# EAGLE design Projects (EAGLE 9.5.1)
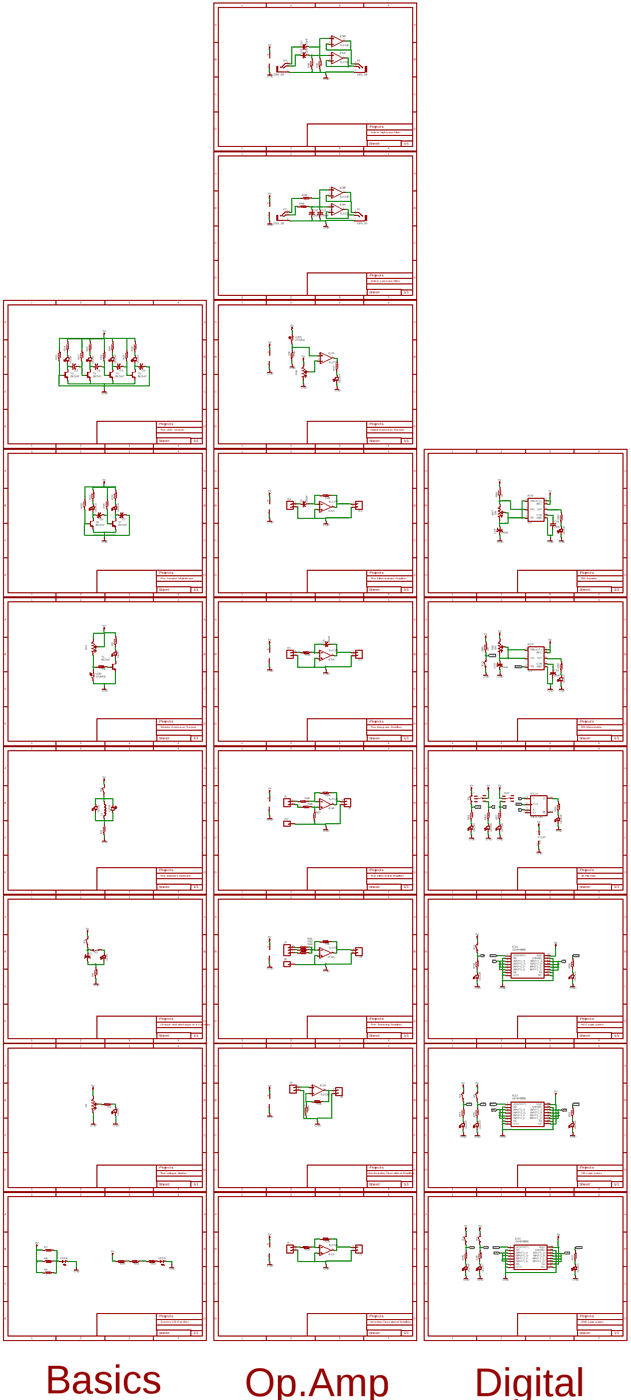
[diagram p0: schematic, sheet 1, overview]
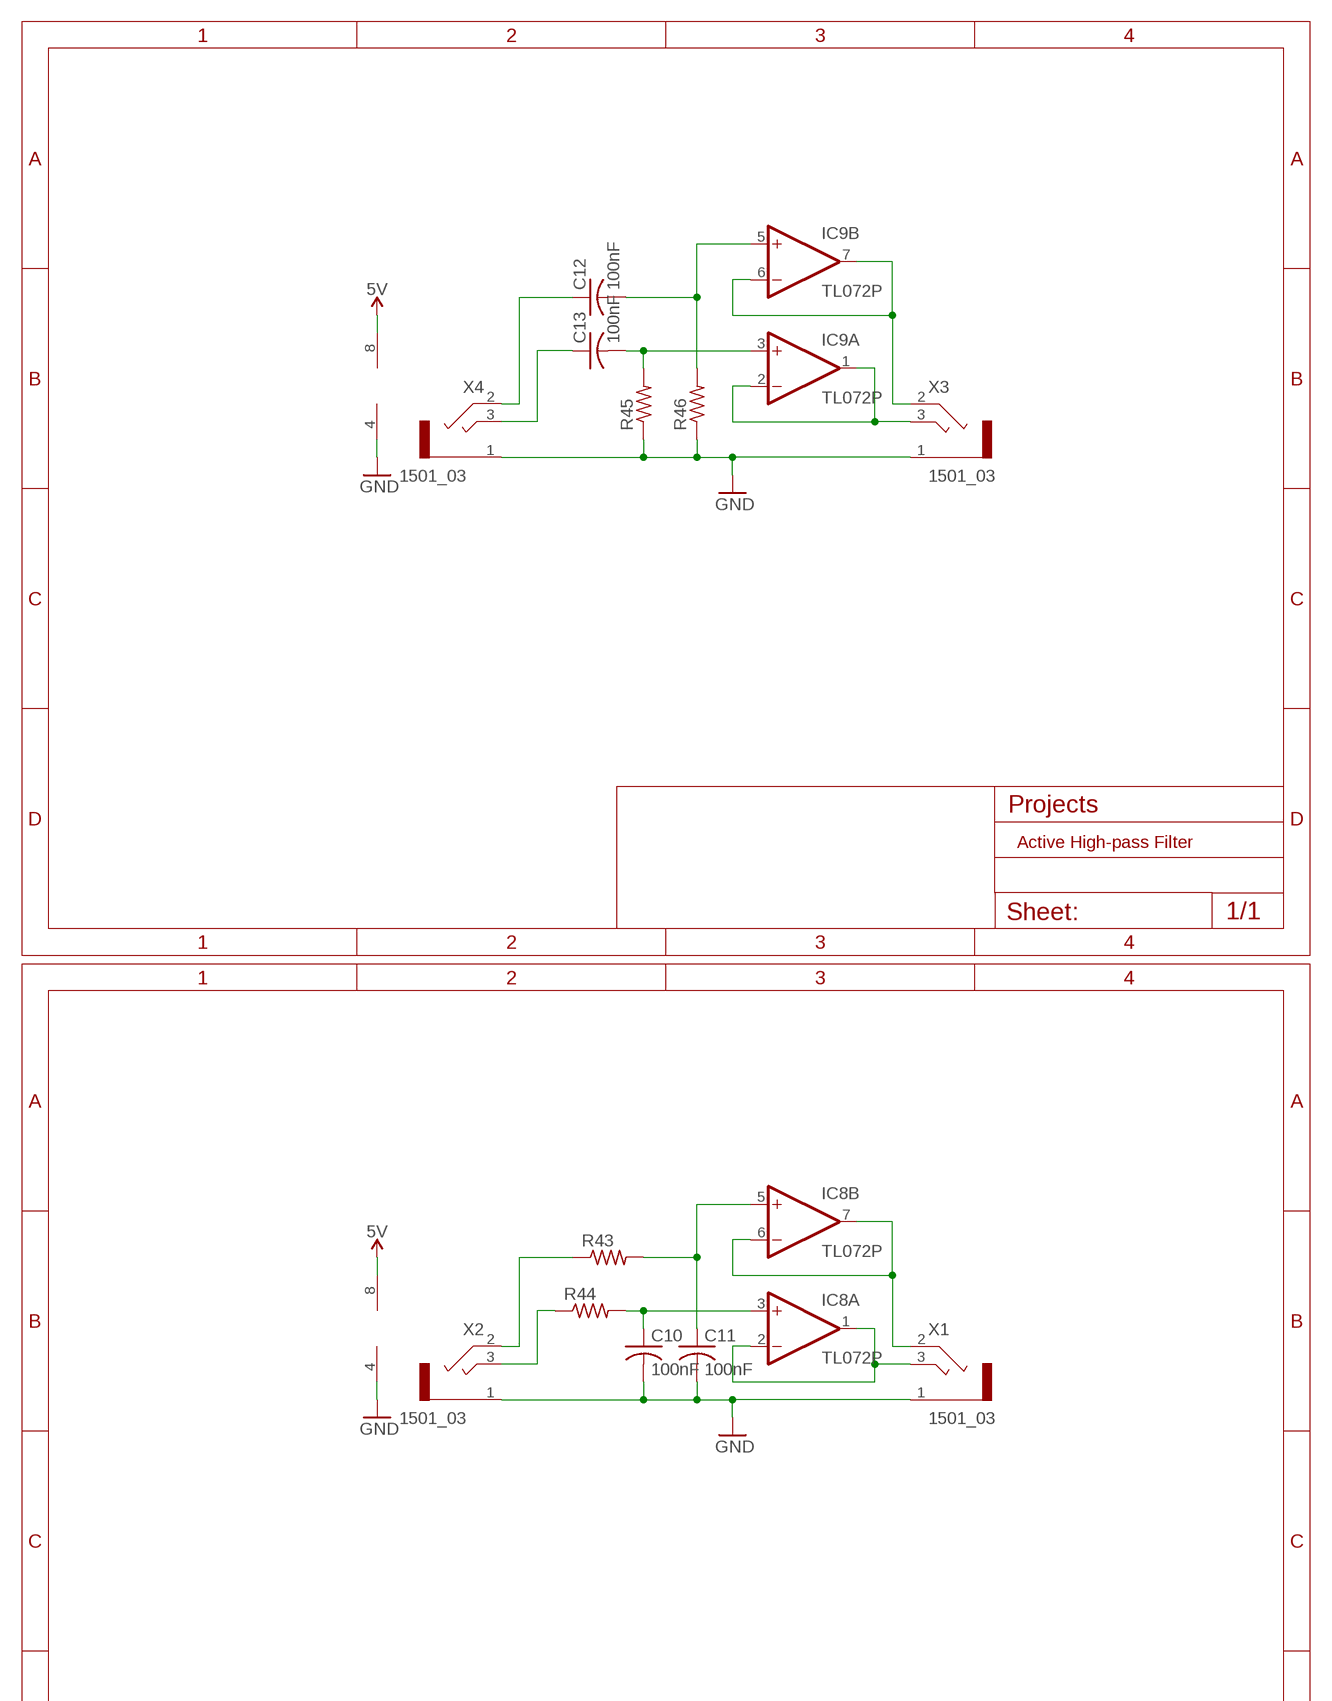
[diagram p1: schematic, sheet 1, part 1 of 7]
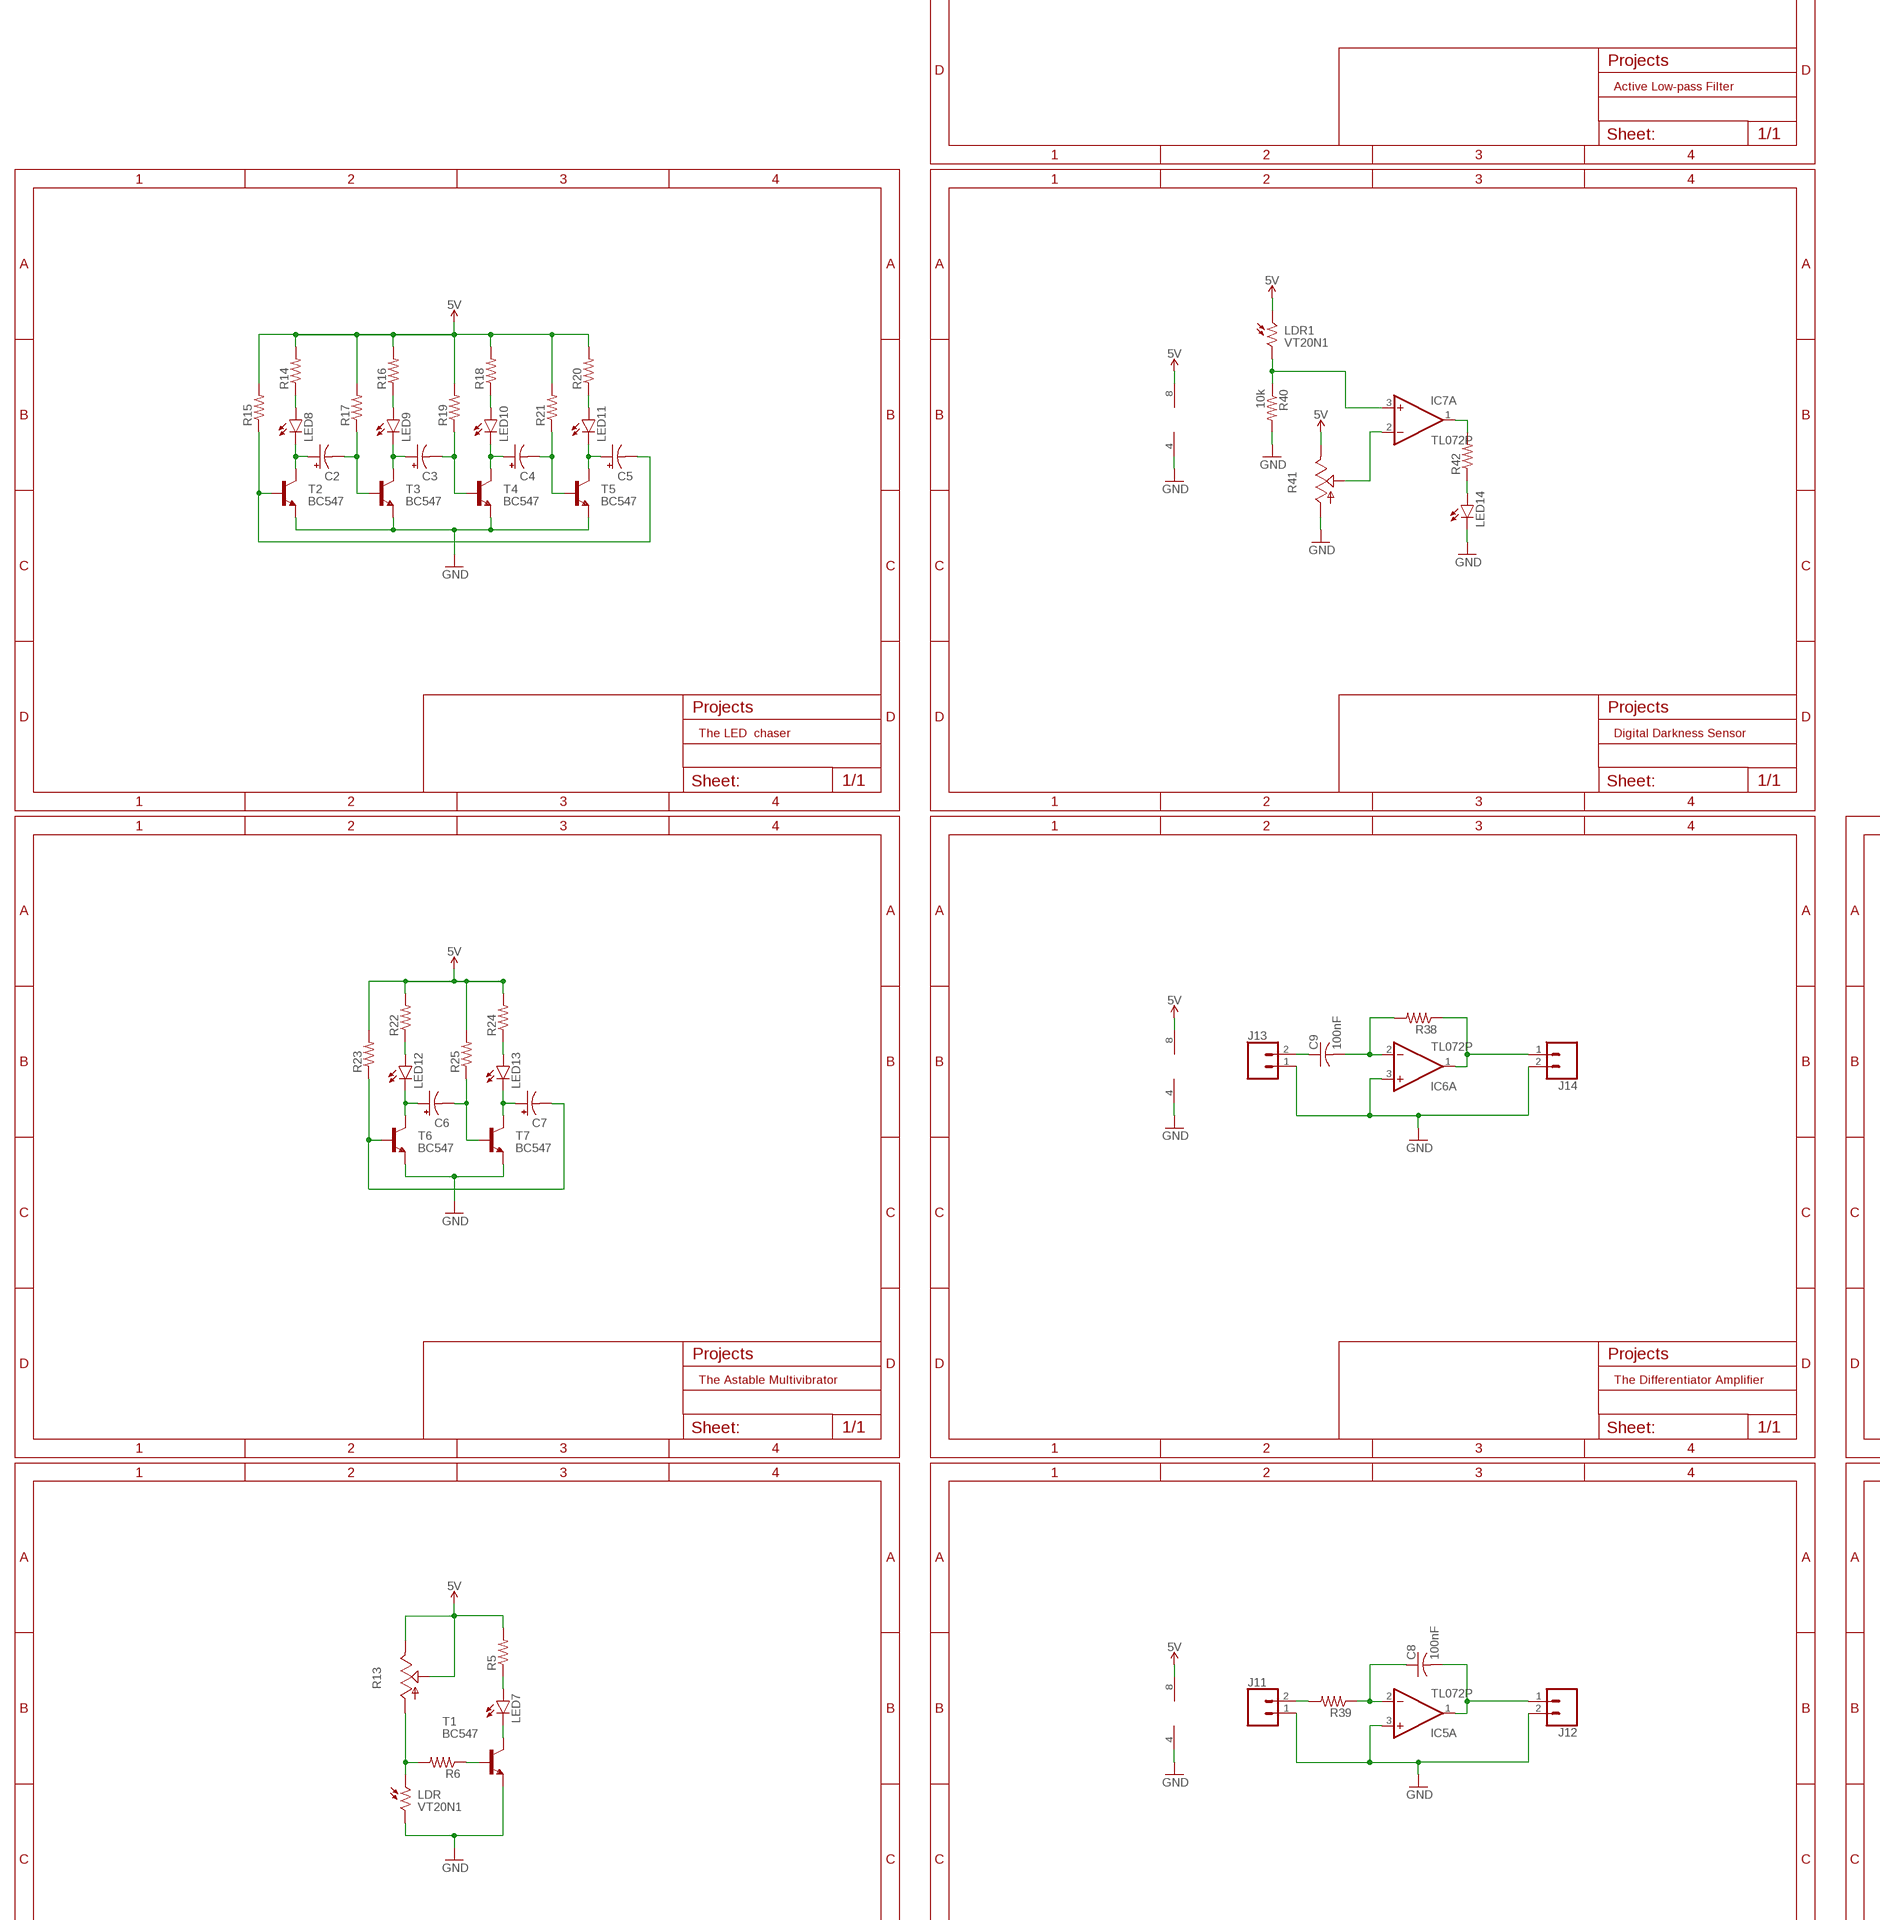
[diagram p2: schematic, sheet 1, part 2 of 7]
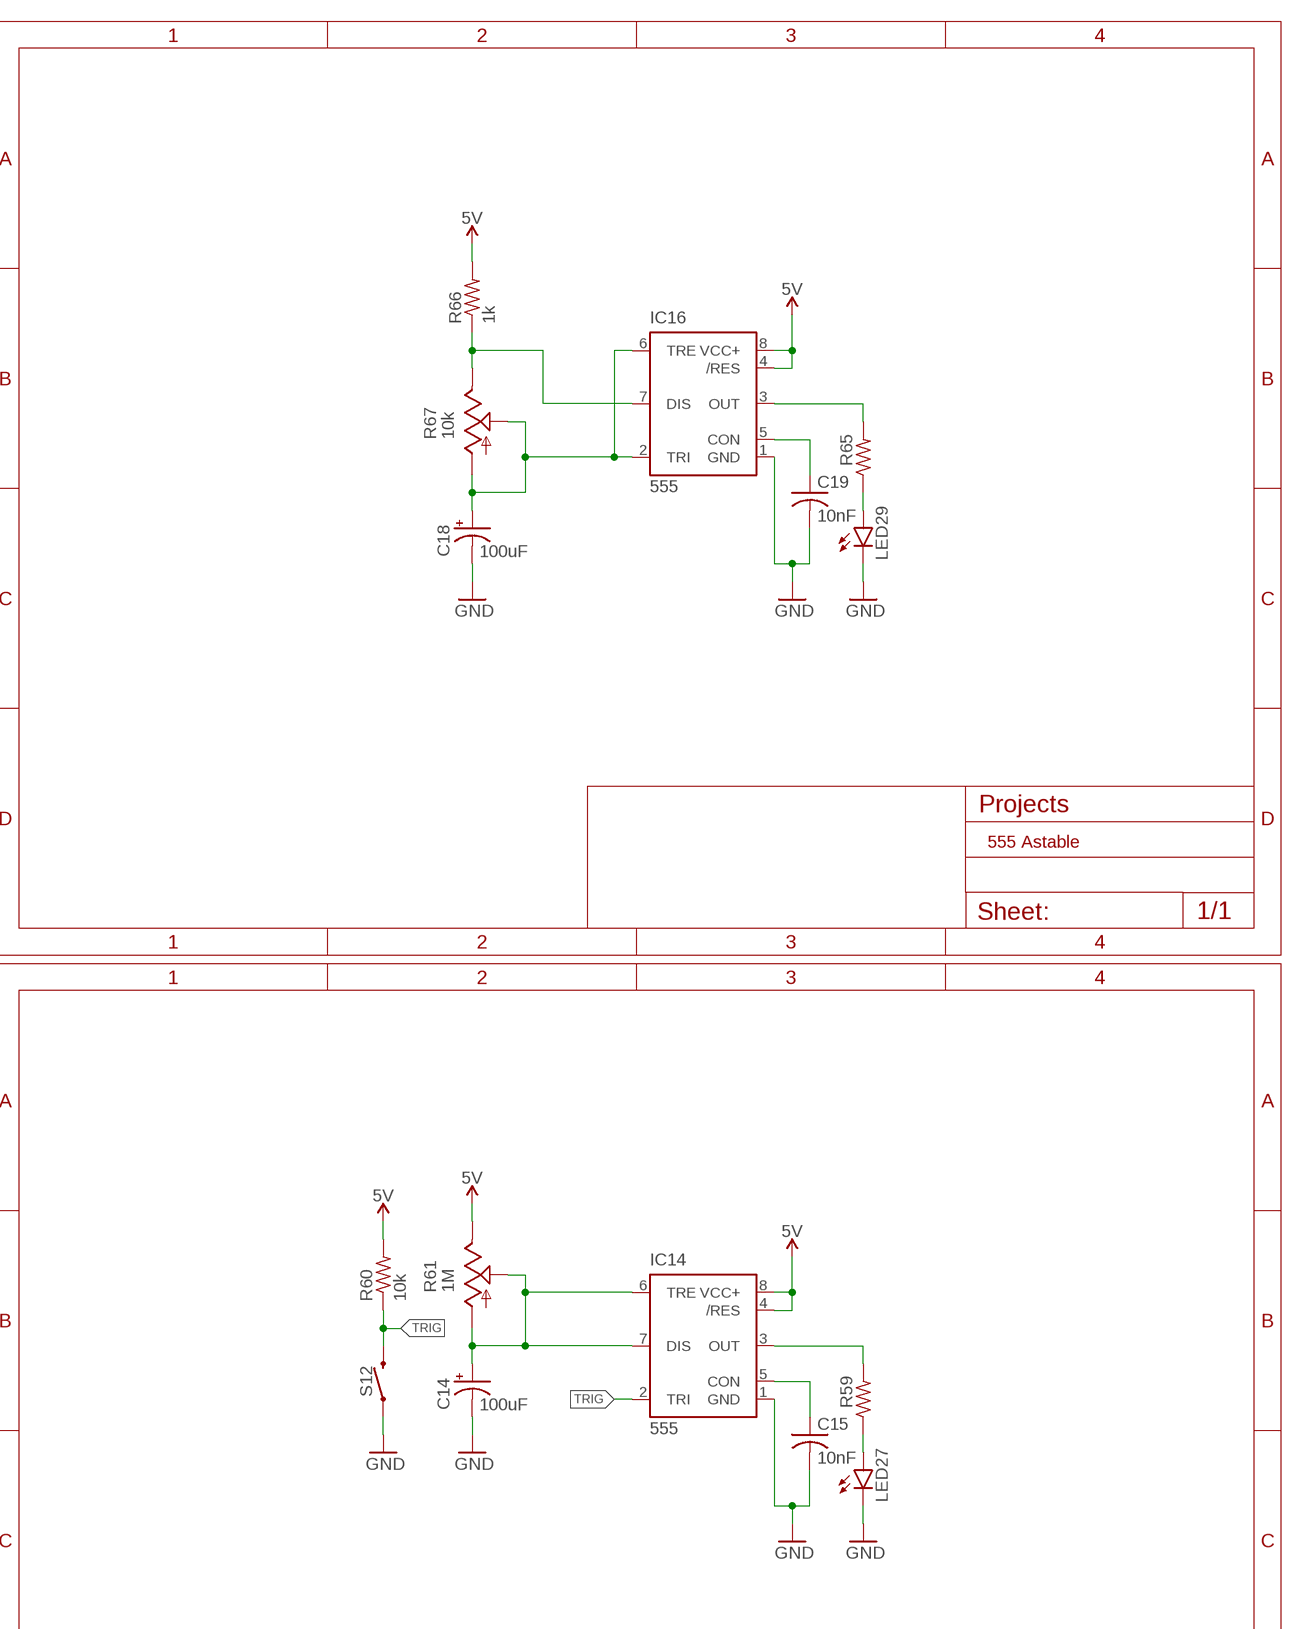
[diagram p3: schematic, sheet 1, part 3 of 7]
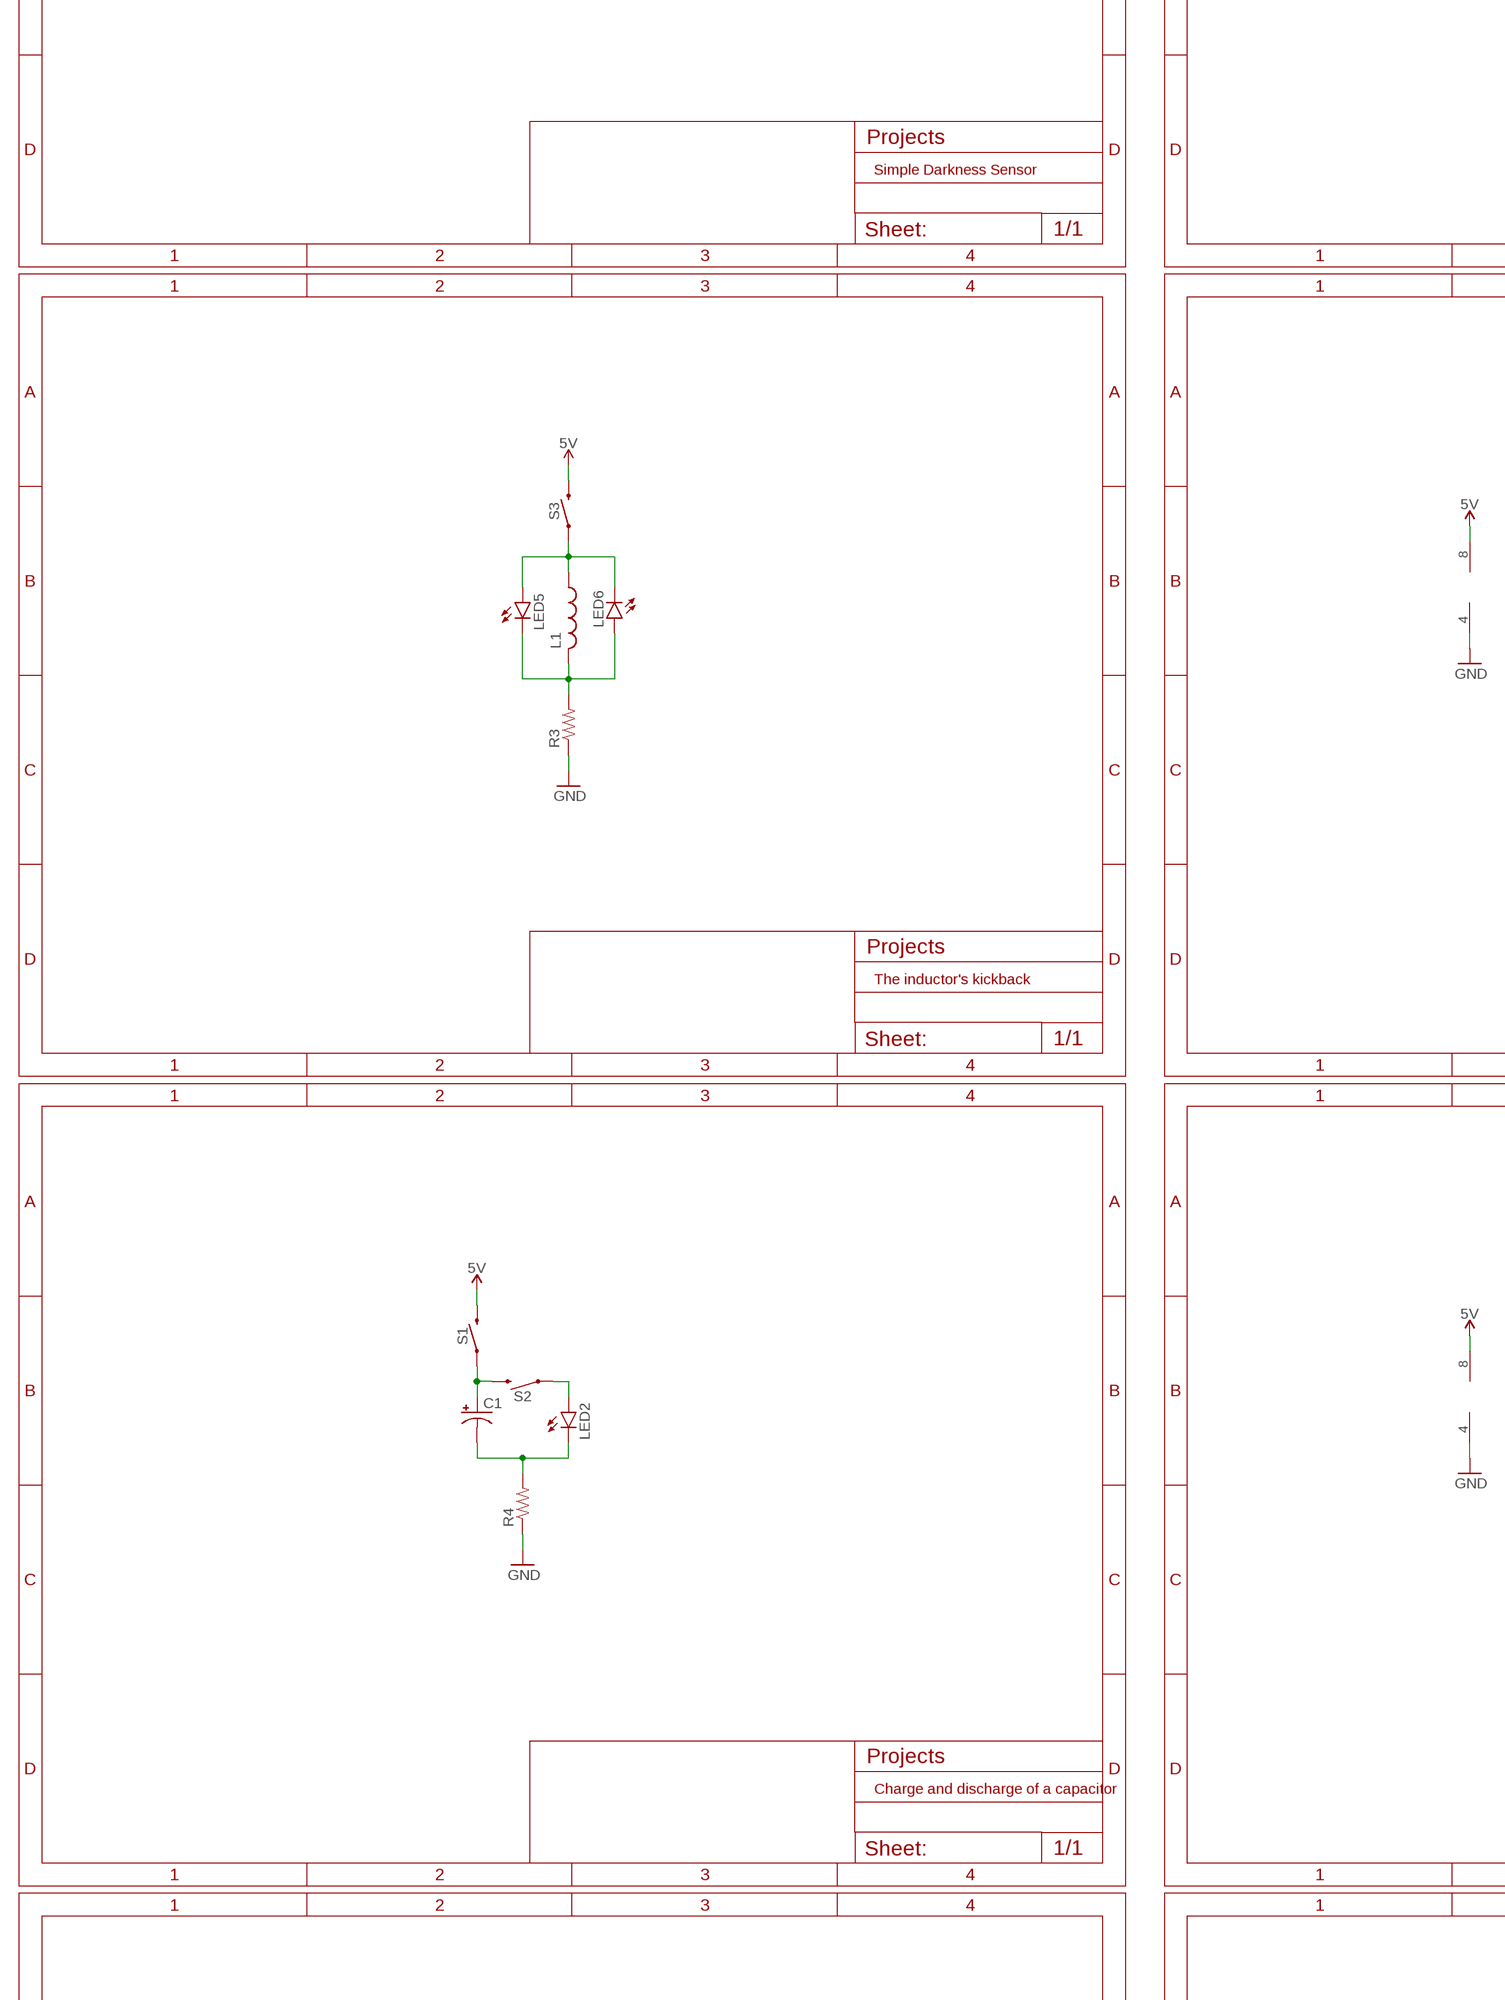
[diagram p4: schematic, sheet 1, part 4 of 7]
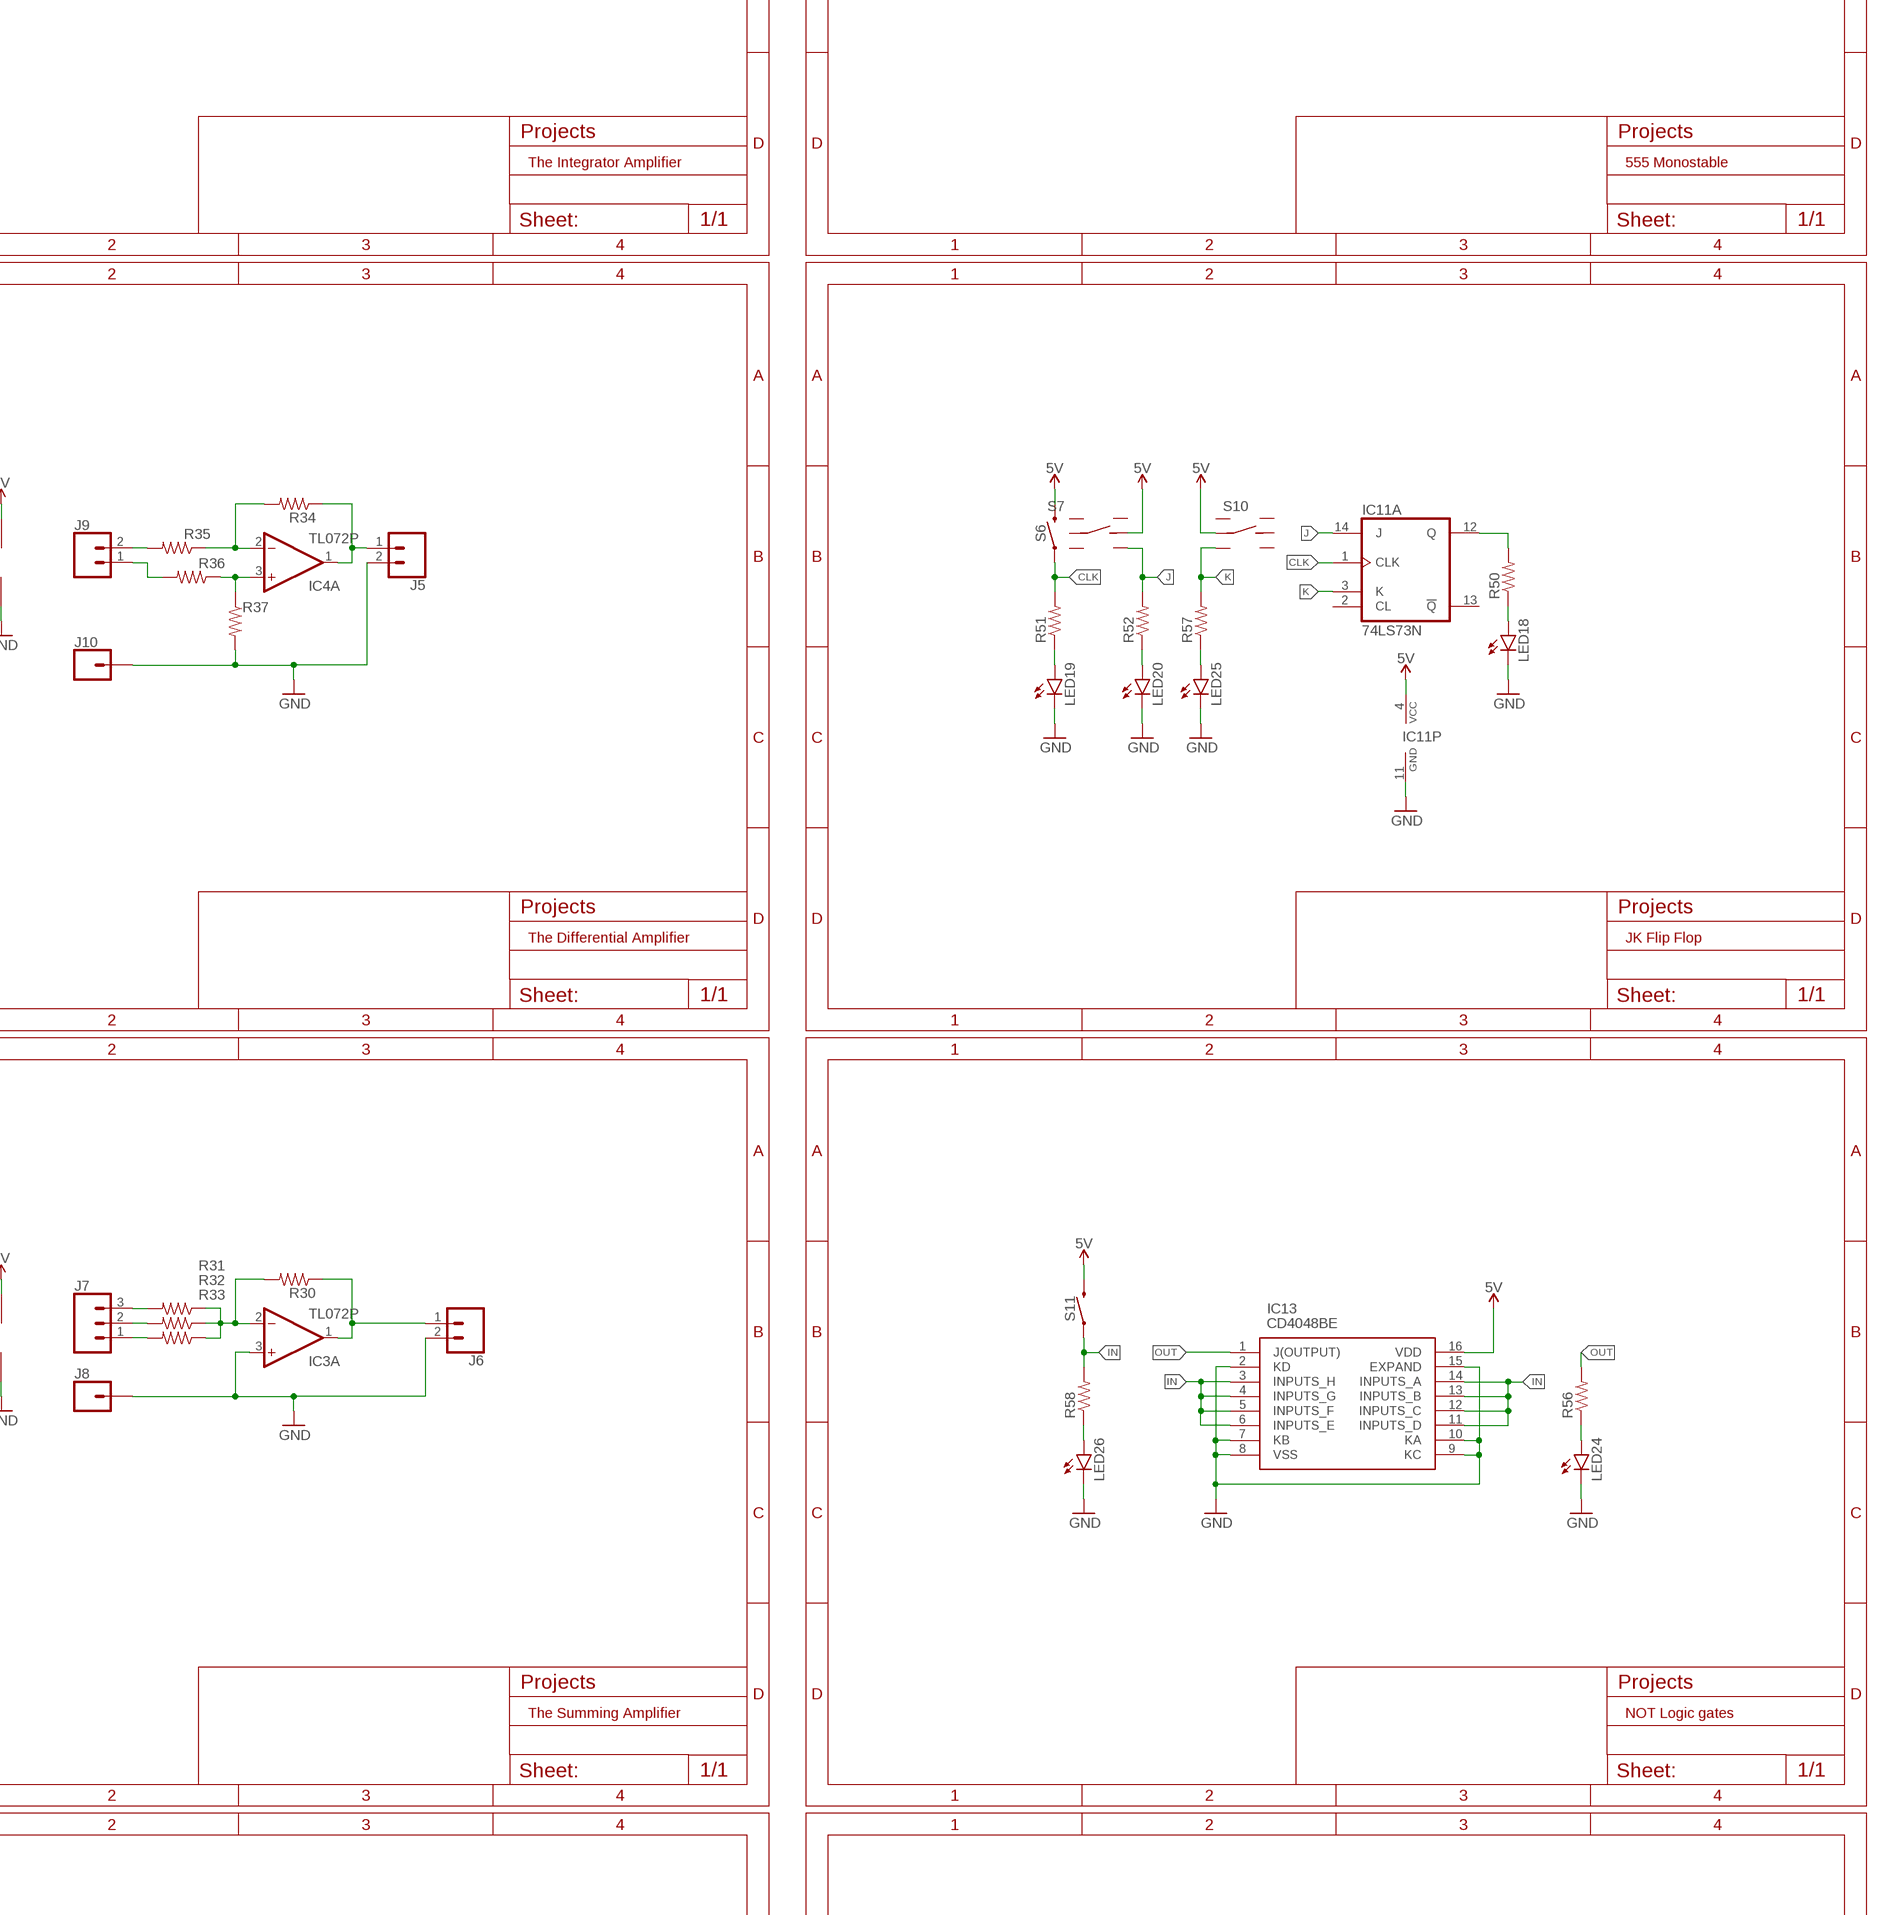
[diagram p5: schematic, sheet 1, part 5 of 7]
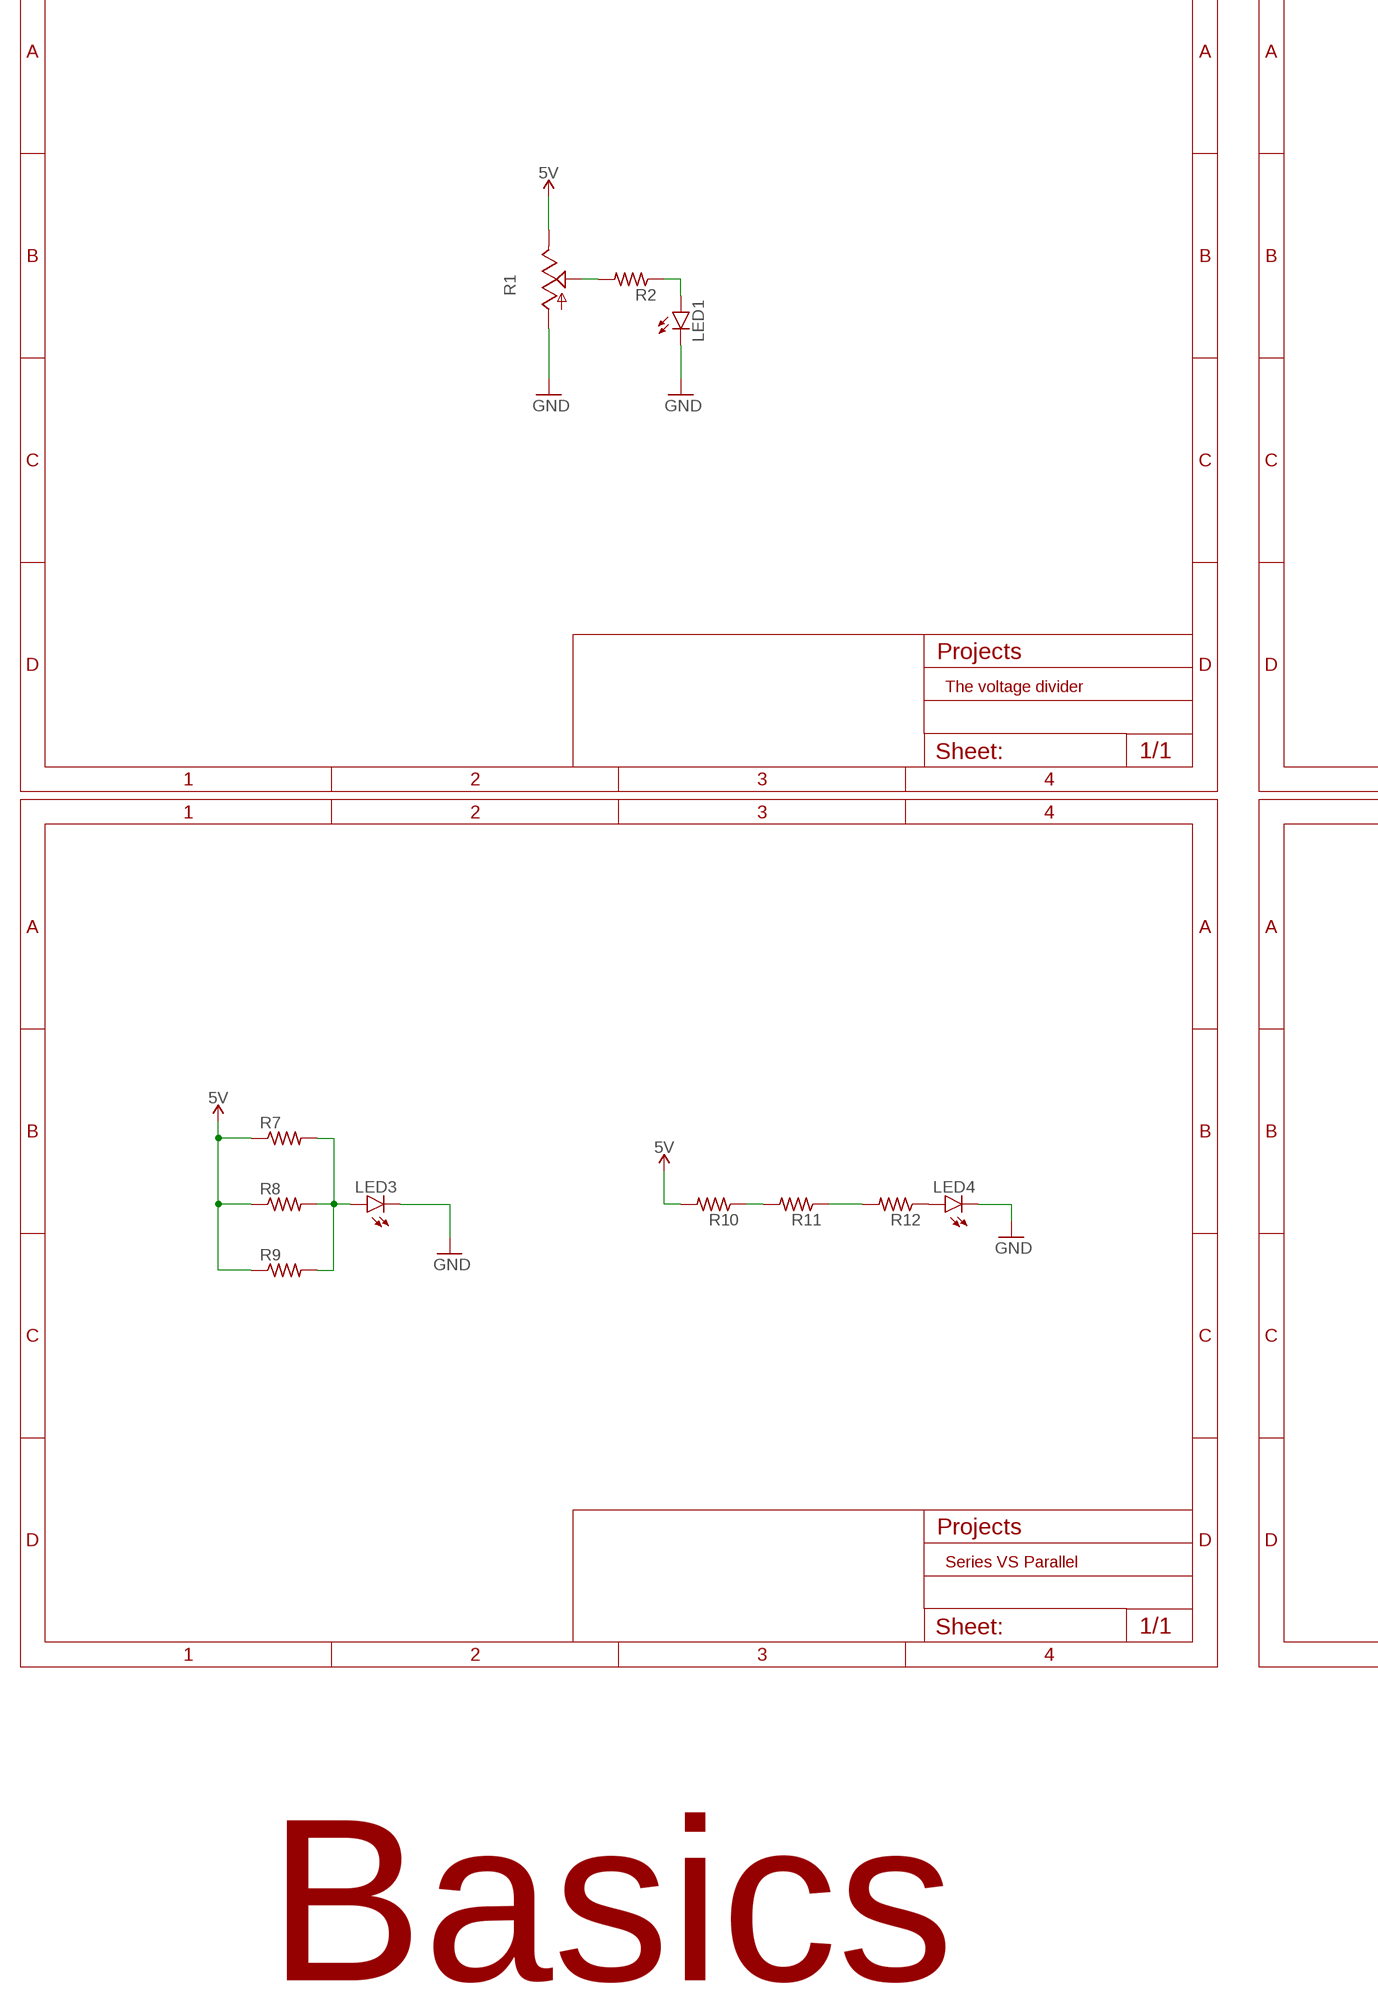
[diagram p6: schematic, sheet 1, part 6 of 7]
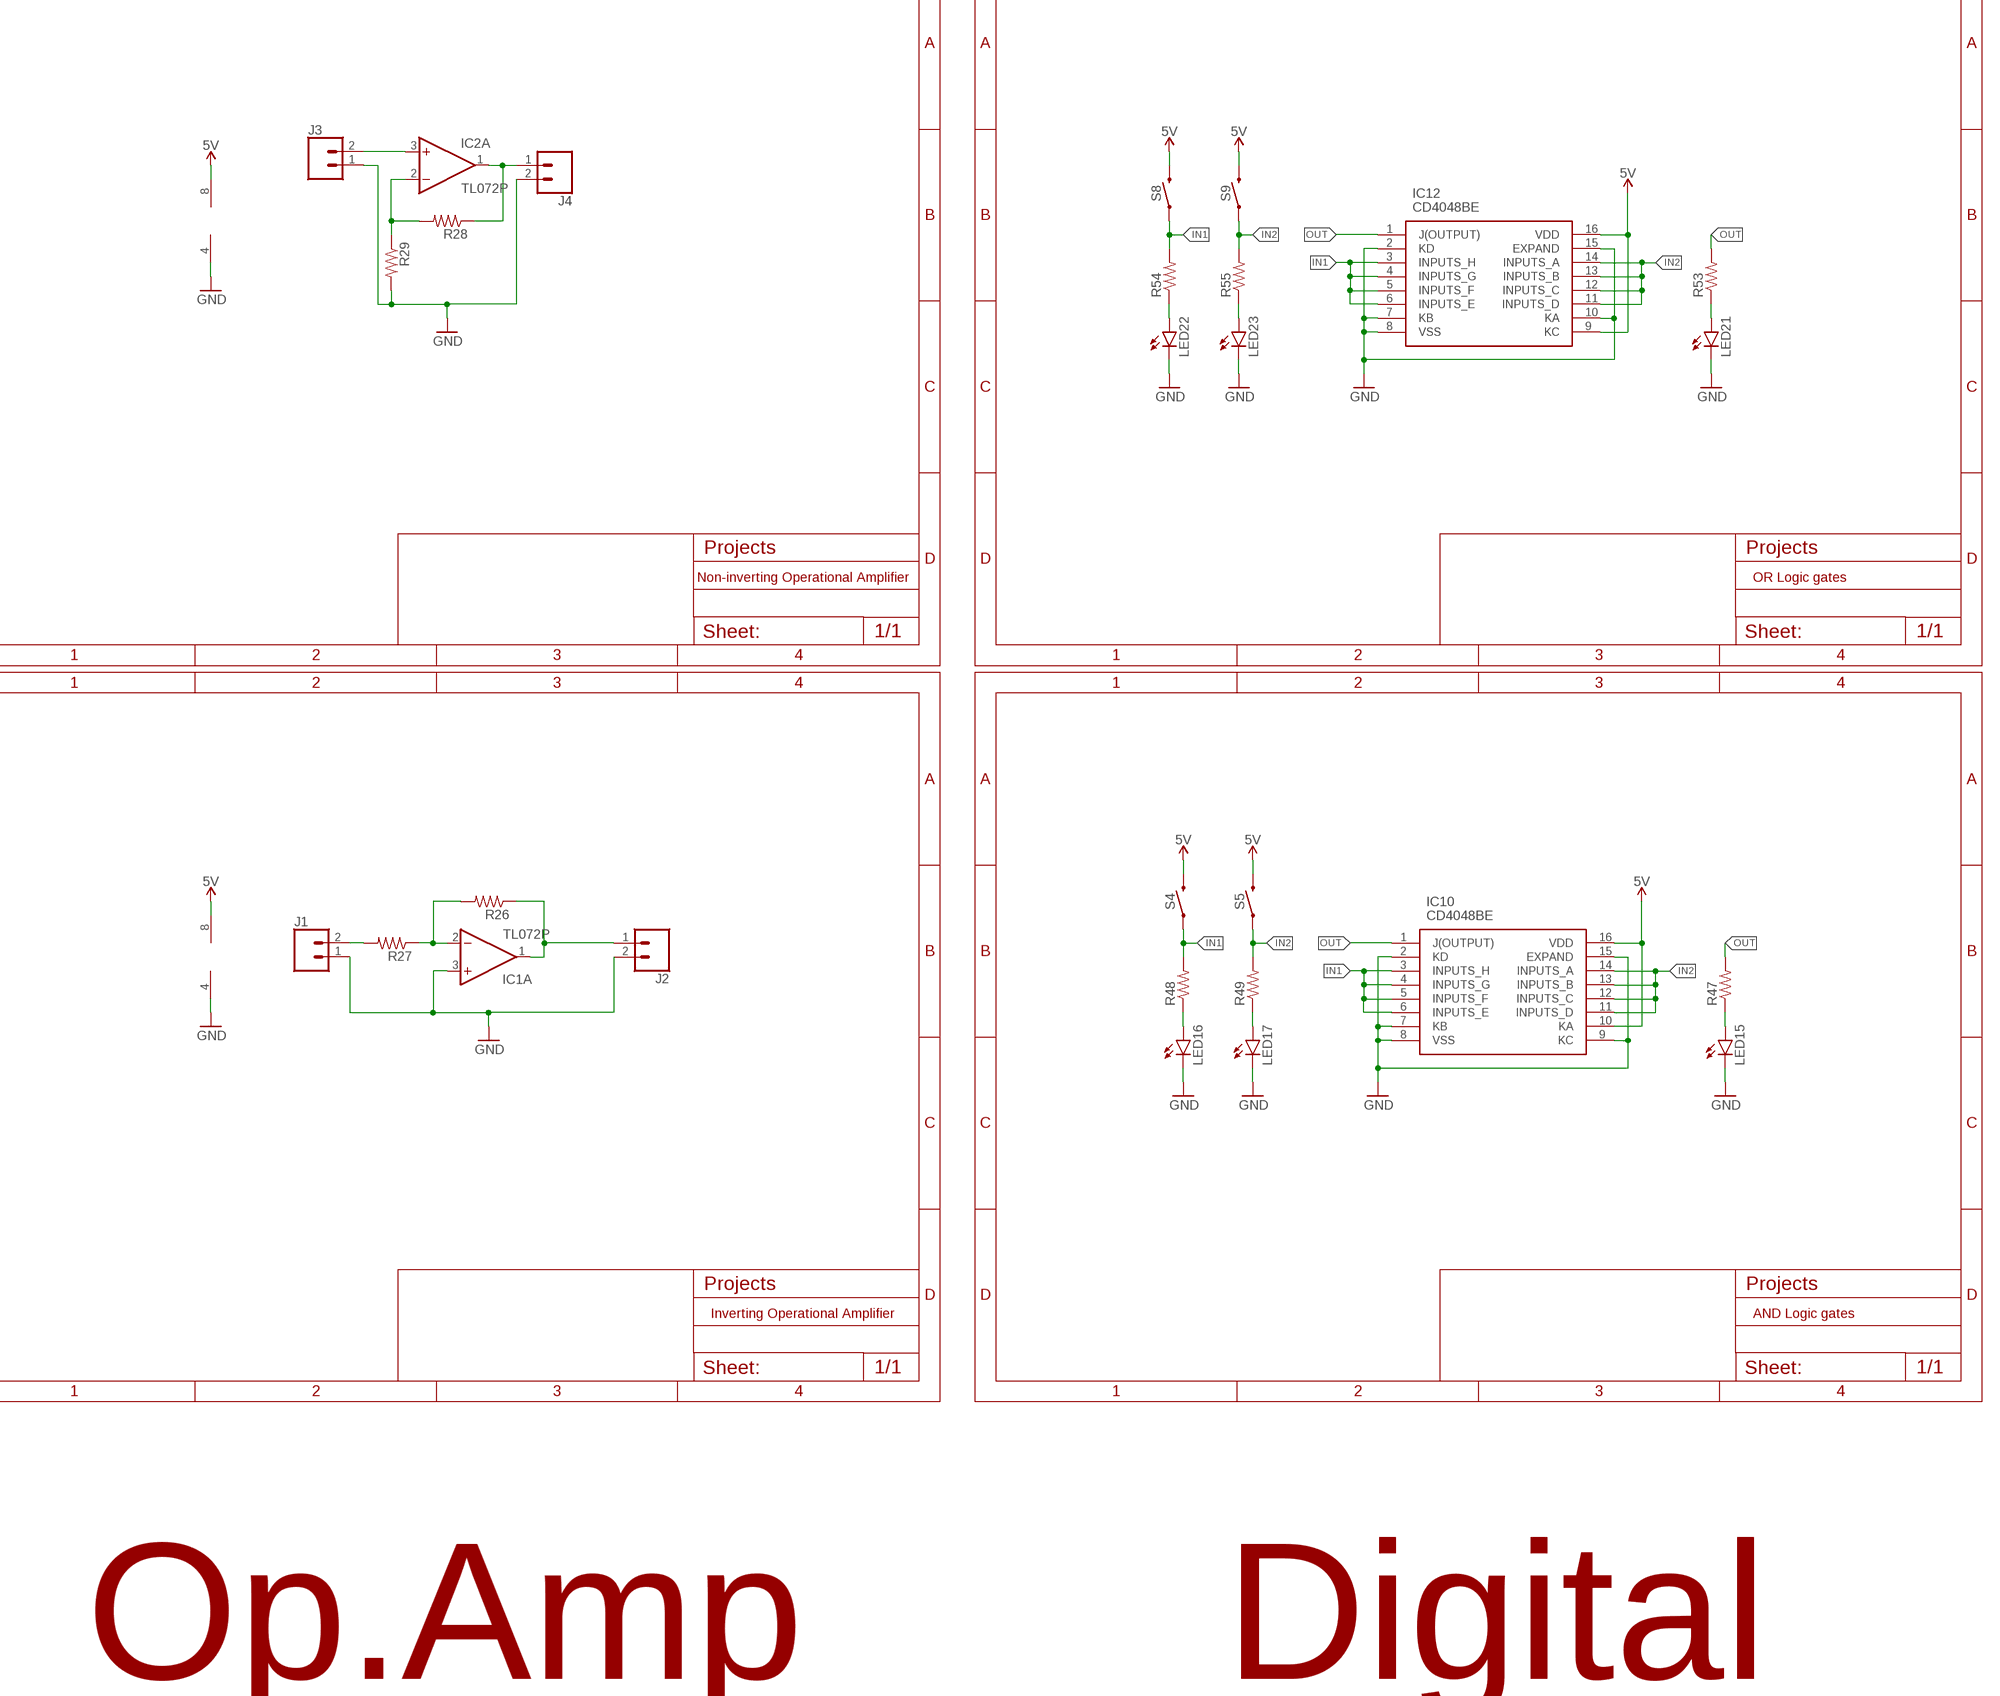
[diagram p7: schematic, sheet 1, part 7 of 7]

## Parts
C1  CPOL-USE5-10.5  [E5-10,5]
C2  CPOL-USE2.5-7  [E2,5-7]
C3  CPOL-USE2.5-7  [E2,5-7]
C4  CPOL-USE2.5-7  [E2,5-7]
C5  CPOL-USE2.5-7  [E2,5-7]
C6  CPOL-USE2.5-7  [E2,5-7]
C7  CPOL-USE2.5-7  [E2,5-7]
C8  100nF  C-US050-025X075  [C050-025X075]
C9  100nF  C-US050-025X075  [C050-025X075]
C10  100nF  C-US050-025X075  [C050-025X075]
C11  100nF  C-US050-025X075  [C050-025X075]
C12  100nF  C-US050-025X075  [C050-025X075]
C13  100nF  C-US050-025X075  [C050-025X075]
C14  100uF  CPOL-USE2.5-7  [E2,5-7]
C15  10nF  C-US050-025X075  [C050-025X075]
C18  100uF  CPOL-USE2.5-7  [E2,5-7]
C19  10nF  C-US050-025X075  [C050-025X075]
IC1  TL072P  [DIL08]
IC2  TL072P  [DIL08]
IC3  TL072P  [DIL08]
IC4  TL072P  [DIL08]
IC5  TL072P  [DIL08]
IC6  TL072P  [DIL08]
IC7  TL072P  [DIL08]
IC8  TL072P  [DIL08]
IC9  TL072P  [DIL08]
IC10  CD4048BE  [DIP794W53P254L1930H508Q16N]
IC11  74LS73N  [DIL14]
IC12  CD4048BE  [DIP794W53P254L1930H508Q16N]
IC13  CD4048BE  [DIP794W53P254L1930H508Q16N]
IC14  555  555KIT  [DIP08-KIT]
IC16  555  555KIT  [DIP08-KIT]
J1  CONN_02  [1X02]
J2  CONN_02  [1X02]
J3  CONN_02  [1X02]
J4  CONN_02  [1X02]
J5  CONN_02  [1X02]
J6  CONN_02  [1X02]
J7  455-1750-1-ND  CONN_03  [1X03]
J8  CONN_01  [1X01]
J9  CONN_02  [1X02]
J10  CONN_01  [1X01]
J11  CONN_02  [1X02]
J12  CONN_02  [1X02]
J13  CONN_02  [1X02]
J14  CONN_02  [1X02]
L1  L-US6000-XXX-RC  [6000-XXXX-RC]
LDR  VT20N1  [TO46-VT200]
LDR1  VT20N1  [TO46-VT200]
LED1  LED5MM  [LED5MM]
LED2  LED5MM  [LED5MM]
LED3  LED5MM  [LED5MM]
LED4  LED5MM  [LED5MM]
LED5  LED5MM  [LED5MM]
LED6  LED5MM  [LED5MM]
LED7  LED5MM  [LED5MM]
LED8  LED5MM  [LED5MM]
LED9  LED5MM  [LED5MM]
LED10  LED5MM  [LED5MM]
LED11  LED5MM  [LED5MM]
LED12  LED5MM  [LED5MM]
LED13  LED5MM  [LED5MM]
LED14  LED5MM  [LED5MM]
LED15  LED5MM  [LED5MM]
LED16  LED5MM  [LED5MM]
LED17  LED5MM  [LED5MM]
LED18  LED5MM  [LED5MM]
LED19  LED5MM  [LED5MM]
LED20  LED5MM  [LED5MM]
LED21  LED5MM  [LED5MM]
LED22  LED5MM  [LED5MM]
LED23  LED5MM  [LED5MM]
LED24  LED5MM  [LED5MM]
LED25  LED5MM  [LED5MM]
LED26  LED5MM  [LED5MM]
LED27  LED5MM  [LED5MM]
LED29  LED5MM  [LED5MM]
R1  TRIM_US-S63P  [S63P]
R2  R-US_0204/7  [0204/7]
R3  R-US_0204/7  [0204/7]
R4  R-US_0204/7  [0204/7]
R5  R-US_0204/7  [0204/7]
R6  R-US_0204/7  [0204/7]
R7  R-US_0204/7  [0204/7]
R8  R-US_0204/7  [0204/7]
R9  R-US_0204/7  [0204/7]
R10  R-US_0204/7  [0204/7]
R11  R-US_0204/7  [0204/7]
R12  R-US_0204/7  [0204/7]
R13  TRIM_US-S63P  [S63P]
R14  R-US_0204/7  [0204/7]
R15  R-US_0204/7  [0204/7]
R16  R-US_0204/7  [0204/7]
R17  R-US_0204/7  [0204/7]
R18  R-US_0204/7  [0204/7]
R19  R-US_0204/7  [0204/7]
R20  R-US_0204/7  [0204/7]
R21  R-US_0204/7  [0204/7]
R22  R-US_0204/7  [0204/7]
R23  R-US_0204/7  [0204/7]
R24  R-US_0204/7  [0204/7]
R25  R-US_0204/7  [0204/7]
R26  R-US_0204/7  [0204/7]
R27  R-US_0204/7  [0204/7]
R28  R-US_0204/7  [0204/7]
R29  R-US_0204/7  [0204/7]
R30  R-US_0204/7  [0204/7]
R31  R-US_0204/7  [0204/7]
R32  R-US_0204/7  [0204/7]
R33  R-US_0204/7  [0204/7]
R34  R-US_0204/7  [0204/7]
R35  R-US_0204/7  [0204/7]
R36  R-US_0204/7  [0204/7]
R37  R-US_0204/7  [0204/7]
R38  R-US_0204/7  [0204/7]
R39  R-US_0204/7  [0204/7]
R40  10k  R-US_0204/7  [0204/7]
R41  TRIM_US-S63P  [S63P]
R42  R-US_0204/7  [0204/7]
R43  R-US_0204/7  [0204/7]
R44  R-US_0204/7  [0204/7]
R45  R-US_0204/7  [0204/7]
R46  R-US_0204/7  [0204/7]
R47  R-US_0204/7  [0204/7]
R48  R-US_0204/7  [0204/7]
R49  R-US_0204/7  [0204/7]
R50  R-US_0204/7  [0204/7]
R51  R-US_0204/7  [0204/7]
R52  R-US_0204/7  [0204/7]
R53  R-US_0204/7  [0204/7]
R54  R-US_0204/7  [0204/7]
R55  R-US_0204/7  [0204/7]
R56  R-US_0204/7  [0204/7]
R57  R-US_0204/7  [0204/7]
R58  R-US_0204/7  [0204/7]
R59  R-US_0204/7  [0204/7]
R60  10k  R-US_0204/7  [0204/7]
R61  1M  TRIM_US-S63P  [S63P]
R65  R-US_0204/7  [0204/7]
R66  1k  R-US_0204/7  [0204/7]
R67  10k  TRIM_US-S63P  [S63P]
S1  MOMENTARY-SWITCH-SPST-PTH-6.0MM  [TACTILE_SWITCH_PTH_6.0MM]
S2  MOMENTARY-SWITCH-SPST-PTH-6.0MM  [TACTILE_SWITCH_PTH_6.0MM]
S3  MOMENTARY-SWITCH-SPST-PTH-6.0MM  [TACTILE_SWITCH_PTH_6.0MM]
S4  MOMENTARY-SWITCH-SPST-PTH-6.0MM  [TACTILE_SWITCH_PTH_6.0MM]
S5  MOMENTARY-SWITCH-SPST-PTH-6.0MM  [TACTILE_SWITCH_PTH_6.0MM]
S6  MOMENTARY-SWITCH-SPST-PTH-6.0MM  [TACTILE_SWITCH_PTH_6.0MM]
S7  DPDT_JS202011CQN  [DPDT_JS202011CQN]
S8  MOMENTARY-SWITCH-SPST-PTH-6.0MM  [TACTILE_SWITCH_PTH_6.0MM]
S9  MOMENTARY-SWITCH-SPST-PTH-6.0MM  [TACTILE_SWITCH_PTH_6.0MM]
S10  DPDT_JS202011CQN  [DPDT_JS202011CQN]
S11  MOMENTARY-SWITCH-SPST-PTH-6.0MM  [TACTILE_SWITCH_PTH_6.0MM]
S12  MOMENTARY-SWITCH-SPST-PTH-6.0MM  [TACTILE_SWITCH_PTH_6.0MM]
T1  BC547  [TO92]
T2  BC547  [TO92]
T3  BC547  [TO92]
T4  BC547  [TO92]
T5  BC547  [TO92]
T6  BC547  [TO92]
T7  BC547  [TO92]
X1  1501_03  [1501_03]
X2  1501_03  [1501_03]
X3  1501_03  [1501_03]
X4  1501_03  [1501_03]

## Nets
5V: IC1.8(P:V+) IC2.8(P:V+) IC3.8(P:V+) IC4.8(P:V+) IC5.8(P:V+) IC6.8(P:V+) IC7.8(P:V+) IC8.8(P:V+) IC9.8(P:V+) IC10.10(KA) IC10.16(VDD) IC11.4(P:VCC) IC12.9(KC) IC12.16(VDD) IC13.16(VDD) IC14.4(/RES) IC14.8(VCC+) IC16.4(/RES) IC16.8(VCC+) LDR1.1 R1.E R5.2 R7.1 R8.1 R9.1 R10.2 R13.E R13.S R14.2 R15.2 R16.2 R17.2 R18.2 R19.2 R20.2 R21.2 R22.2 R23.2 R24.2 R25.2 R41.E R60.2 R61.E R66.2 S1.3 S3.3 S4.3 S5.3 S6.3 S7.5(RC) S8.3 S9.3 S10.2(LC) S11.3
CLK: IC11.1(A:CLK) R51.2 S6.1
GND: C10.2 C11.2 C14.- C15.2 C18.- C19.2 IC1.3(A:+IN) IC1.4(P:V-) IC2.4(P:V-) IC3.3(A:+IN) IC3.4(P:V-) IC4.4(P:V-) IC5.3(A:+IN) IC5.4(P:V-) IC6.3(A:+IN) IC6.4(P:V-) IC7.4(P:V-) IC8.4(P:V-) IC9.4(P:V-) IC10.2(KD) IC10.7(KB) IC10.8(VSS) IC10.9(KC) IC10.15(EXPAND) IC11.11(P:GND) IC12.2(KD) IC12.7(KB) IC12.8(VSS) IC12.10(KA) IC12.15(EXPAND) IC13.2(KD) IC13.7(KB) IC13.8(VSS) IC13.9(KC) IC13.10(KA) IC13.15(EXPAND) IC14.1(GND) IC16.1(GND) J1.1 J2.2 J3.1 J4.2 J5.2 J6.2 J8.1 J10.1 J11.1 J12.2 J13.1 J14.2 LDR.2 LED1.K(C) LED3.K(C) LED4.K(C) LED14.K(C) LED15.K(C) LED16.K(C) LED17.K(C) LED18.K(C) LED19.K(C) LED20.K(C) LED21.K(C) LED22.K(C) LED23.K(C) LED24.K(C) LED25.K(C) LED26.K(C) LED27.K(C) LED29.K(C) R1.A R3.1 R4.1 R29.2 R37.2 R40.2 R41.A R45.1 R46.1 S12.1 T1.1(E) T2.1(E) T3.1(E) T4.1(E) T5.1(E) T6.1(E) T7.1(E) X1.1 X2.1 X3.1 X4.1
IN: IC13.3(INPUTS_H) IC13.4(INPUTS_G) IC13.5(INPUTS_F) IC13.6(INPUTS_E) IC13.11(INPUTS_D) IC13.12(INPUTS_C) IC13.13(INPUTS_B) IC13.14(INPUTS_A) R58.2 S11.1
IN1: IC10.3(INPUTS_H) IC10.4(INPUTS_G) IC10.5(INPUTS_F) IC10.6(INPUTS_E) IC12.3(INPUTS_H) IC12.4(INPUTS_G) IC12.5(INPUTS_F) IC12.6(INPUTS_E) R48.2 R54.2 S4.1 S8.1
IN2: IC10.11(INPUTS_D) IC10.12(INPUTS_C) IC10.13(INPUTS_B) IC10.14(INPUTS_A) IC12.11(INPUTS_D) IC12.12(INPUTS_C) IC12.13(INPUTS_B) IC12.14(INPUTS_A) R49.2 R55.2 S5.1 S9.1
J: IC11.14(A:J) R52.2 S7.6(R2)
K: IC11.3(A:K) R57.2 S10.3(L2)
N$1: LED4.A R12.1
N$2: R1.S R2.2
N$3: LED1.A R2.1
N$4: C1.+ S1.1 S2.3
N$5: C1.- LED2.K(C) R4.2
N$6: R10.1 R11.2
N$7: R11.1 R12.2
N$8: LED3.A R7.2 R8.2 R9.2
N$10: LED2.A S2.1
N$11: L1.1 LED5.A LED6.K(C) S3.1
N$12: L1.2 LED5.K(C) LED6.A R3.2
N$13: R6.1 T1.2(B)
N$14: LDR.1 R6.2 R13.A
N$15: C6.+ LED12.K(C) T6.3(C)
N$16: LED7.K(C) T1.3(C)
N$17: LED7.A R5.1
N$18: C2.- R17.1 T3.2(B)
N$19: C2.+ LED8.K(C) T2.3(C)
N$20: LED8.A R14.1
N$21: C3.+ LED9.K(C) T3.3(C)
N$22: LED9.A R16.1
N$23: IC2.2(A:-IN) R28.2 R29.1
N$24: C3.- R19.1 T4.2(B)
N$25: C4.+ LED10.K(C) T4.3(C)
N$26: LED10.A R18.1
N$27: IC2.3(A:+IN) J3.2
N$28: C4.- R21.1 T5.2(B)
N$29: C5.+ LED11.K(C) T5.3(C)
N$30: LED11.A R20.1
N$31: IC1.2(A:-IN) R26.2 R27.1
N$32: C5.- R15.1 T2.2(B)
N$33: LED12.A R22.1
N$34: C6.- R25.1 T7.2(B)
N$35: C7.+ LED13.K(C) T7.3(C)
N$36: LED13.A R24.1
N$37: J1.2 R27.2
N$38: IC2.1(A:OUT) J4.1 R28.1
N$39: IC3.2(A:-IN) R30.2 R31.1 R32.1 R33.1
N$40: J7.2 R31.2
N$41: J7.3 R32.2
N$42: J7.1 R33.2
N$43: IC1.1(A:OUT) J2.1 R26.1
N$44: IC3.1(A:OUT) J6.1 R30.1
N$45: IC4.2(A:-IN) R34.2 R35.1
N$46: C7.- R23.1 T6.2(B)
N$47: J9.2 R35.2
N$48: IC4.3(A:+IN) R36.1 R37.1
N$49: J9.1 R36.2
N$50: IC4.1(A:OUT) J5.1 R34.1
N$51: C8.1 IC5.2(A:-IN) R39.1
N$52: J11.2 R39.2
N$53: C8.2 IC5.1(A:OUT) J12.1
N$54: C9.2 IC6.2(A:-IN) R38.2
N$55: C9.1 J13.2
N$56: IC6.1(A:OUT) J14.1 R38.1
N$57: IC7.3(A:+IN) LDR1.2 R40.1
N$58: IC7.2(A:-IN) R41.S
N$59: LED14.A R42.1
N$60: IC7.1(A:OUT) R42.2
N$61: R43.1 X2.2
N$62: R44.1 X2.3
N$63: C10.1 IC8.3(A:+IN) R44.2
N$64: IC8.1(A:OUT) IC8.2(A:-IN) X1.3
N$65: C11.1 IC8.5(B:+IN) R43.2
N$66: IC8.6(B:-IN) IC8.7(B:OUT) X1.2
N$67: C12.1 X4.2
N$68: C13.1 X4.3
N$69: C13.2 IC9.3(A:+IN) R45.2
N$70: IC9.1(A:OUT) IC9.2(A:-IN) X3.3
N$71: C12.2 IC9.5(B:+IN) R46.2
N$72: IC9.6(B:-IN) IC9.7(B:OUT) X3.2
N$73: LED16.A R48.1
N$74: LED17.A R49.1
N$75: LED18.A R50.1
N$76: LED15.A R47.1
N$77: LED19.A R51.1
N$78: LED20.A R52.1
N$79: LED21.A R53.1
N$80: LED22.A R54.1
N$81: LED23.A R55.1
N$82: LED24.A R56.1
N$83: LED25.A R57.1
N$84: LED26.A R58.1
N$85: LED27.A R59.1
N$86: C15.1 IC14.5(CON)
N$87: C14.+ IC14.6(TRE) IC14.7(DIS) R61.A R61.S
N$88: IC16.7(DIS) R66.1 R67.E
N$91: LED29.A R65.1
N$93: C19.1 IC16.5(CON)
OUT: IC10.1(J(OUTPUT)) IC11.12(A:Q) IC12.1(J(OUTPUT)) IC13.1(J(OUTPUT)) R47.2 R50.2 R53.2 R56.2
OUT1: IC14.3(OUT) R59.2
OUT3: IC16.3(OUT) R65.2
TRIG: C18.+ IC14.2(TRI) IC16.2(TRI) IC16.6(TRE) R60.1 R67.A R67.S S12.3
Unconnected: IC1.5(B:+IN) IC1.6(B:-IN) IC1.7(B:OUT) IC2.5(B:+IN) IC2.6(B:-IN) IC2.7(B:OUT) IC3.5(B:+IN) IC3.6(B:-IN) IC3.7(B:OUT) IC4.5(B:+IN) IC4.6(B:-IN) IC4.7(B:OUT) IC5.5(B:+IN) IC5.6(B:-IN) IC5.7(B:OUT) IC6.5(B:+IN) IC6.6(B:-IN) IC6.7(B:OUT) IC7.5(B:+IN) IC7.6(B:-IN) IC7.7(B:OUT) IC11.2(A:CL) IC11.5(B:CLK) IC11.6(B:CL) IC11.7(B:J) IC11.8(B:!Q) IC11.9(B:Q) IC11.10(B:K) IC11.13(A:!Q) S7.1(L1) S7.2(LC) S7.3(L2) S7.4(R1) S10.1(L1) S10.4(R1) S10.5(RC) S10.6(R2)

## Notes on the sheet
- Active High-pass Filter
- Active Low-pass Filter
- The LED  chaser | Digital Darkness Sensor
- The Astable Multivibrator | The Differentiator Amplifier | 555 Astable
- Simple Darkness Sensor | The Integrator Amplifier | 555 Monostable
- The inductor's kickback | The Differential Amplifier | JK Flip Flop
- Charge and discharge of a capacitor | The Summing Amplifier | NOT Logic gates
- The voltage divider | Non-inverting Operational Amplifier | OR Logic gates
- Series VS Parallel | Inverting Operational Amplifier | AND Logic gates
- Basics | Op.Amp | Digital

## Library data of the parts
C1-C7 C14 C18 = rcl:CPOL-US: POLARIZED CAPACITOR, American symbol; SPICEPREFIX: C
C8-C13 C15 C19 = rcl:C-US: CAPACITOR, American symbol; SPICEPREFIX: C
IC1-IC9 = linear:TL072: OP AMP
IC10 IC12 IC13 = SamacSys_Parts:CD4048BE: CMOS multifunction expandable 8-input gate Source: Datasheet <http://componentsearchengine.com/Datasheets/1/CD4048BE.pdf>; DESCRIPTION: CMOS multifunction expandable 8-input gate; HEIGHT: 5.08mm; MANUFACTURER_NAME: Texas Instruments; MANUFACTURER_PART_NUMBER: CD4048BE; MOUSER_PART_NUMBER: 595-CD4048BE; MOUSER_PRICE-STOCK: https://www.mouser.co.uk/ProductDetail/Texas-Instruments/CD4048BE?qs=bvpNxolhIUP8zRlx81gMfw%3D%3D
IC11 = 74xx-eu:74*73: Dual J-K FLIP FLOP, clear
IC14 IC16 = SparkFun-IC-Special-Function:555: General purpose bipolar Timer Datasheet <http://www.sparkfun.com/datasheets/Components/General/ne555.pdf> SparkFun Products SparkFun SparkPunk Sequencer Kit <https://www.sparkfun.com/products/12707> (KIT-12707) Storefront Component: 555 Timer <https://www.sparkfun.com/products/9273> (COM-09273) Two parts valid for production: VFP: IC-11930 (M7555 PTH) VFP: IC-09173 (555 PTH) - Preferred; PROD_ID: IC-09173; PROD_ID_ALT: IC-11930
J1-J6 J9 J11-J14 = SparkFun-Connectors:CONN_02: Multi connection point. Often used as Generic Header-pin footprint for 0.1 inch spaced/style header connections On any of the 0.1 inch spaced packages, you can populate with these: Break Away Headers - Straight <https://www.sparkfun.com/products/116> (PRT-00116) Break Away Male Headers - Right Angle <https://www.sparkfun.com/products/553> (PRT-00553) Female Headers <https://www.sparkfun.com/products/115> (PRT-00115) Break Away Headers - Machine Pin <https://www.sparkfun.com/products/117> (PRT-00117) Break Away Female Headers - Swiss Machine Pin <https://www.sparkfun.com/products/743> (PRT-00743) For SCREWTERMINALS and SPRING TERMINALS visit here: Screw Terimnals on SparkFun.com <https://www.sparkfun.com/search/results?term=Screw+Terminals> (5mm/3.5mm/2.54mm spacing) This device is also useful as a general connection point to wire up your design to another part of your project. Our various solder wires solder well into these plated through hole pads. Hook-Up Wire - Assortment (Stranded, 22 AWG) <https://www.sparkfun.com/products/11375> (PRT-11375) Hook-Up Wire - Assortment (Solid Core, 22 AWG) <https://www.sparkfun.com/products/11367> (PRT-11367) View the entire wire category on our website here <https://www.sparkfun.com/categories/141> Special notes: Molex polarized connector foot print use with: PRT-08233 with associated crimp pins and housings. 2.54_SCREWTERM for use with PRT-10571. 3.5mm Screw Terminal footprints for PRT-08084 5mm Screw Terminal footprints for use with PRT-08432
J7 = SparkFun-Connectors:CONN_03: Multi connection point. Often used as Generic Header-pin footprint for 0.1 inch spaced/style header connections On any of the 0.1 inch spaced packages, you can populate with these: Break Away Headers - Straight <https://www.sparkfun.com/products/116> (PRT-00116) Break Away Male Headers - Right Angle <https://www.sparkfun.com/products/553> (PRT-00553) Female Headers <https://www.sparkfun.com/products/115> (PRT-00115) Break Away Headers - Machine Pin <https://www.sparkfun.com/products/117> (PRT-00117) Break Away Female Headers - Swiss Machine Pin <https://www.sparkfun.com/products/743> (PRT-00743) Stackable Header - 3 Pin (Female, 0.1") <https://www.sparkfun.com/products/13875> (PRT-13875) For SCREWTERMINALS and SPRING TERMINALS visit here: Screw Terimnals on SparkFun.com <https://www.sparkfun.com/search/results?term=Screw+Terminals> (5mm/3.5mm/2.54mm spacing) This device is also useful as a general connection point to wire up your design to another part of your project. Our various solder wires solder well into these plated through hole pads. Hook-Up Wire - Assortment (Stranded, 22 AWG) <https://www.sparkfun.com/products/11375> (PRT-11375) Hook-Up Wire - Assortment (Solid Core, 22 AWG) <https://www.sparkfun.com/products/11367> (PRT-11367) View the entire wire category on our website here <https://www.sparkfun.com/categories/141> Special notes: Molex polarized connector foot print use with SKU : PRT-08232 with associated crimp pins and housings.; PROD_ID: XXX-00000
J8 J10 = SparkFun-Connectors:CONN_01: Single connection point. Often used as Generic Header-pin footprint for 0.1 inch spaced/style header connections On any of the 0.1 inch spaced packages, you can populate with these: Break Away Headers - Straight <https://www.sparkfun.com/products/116> (PRT-00116) Break Away Male Headers - Right Angle <https://www.sparkfun.com/products/553> (PRT-00553) Female Headers <https://www.sparkfun.com/products/115> (PRT-00115) Break Away Headers - Machine Pin <https://www.sparkfun.com/products/117> (PRT-00117) Break Away Female Headers - Swiss Machine Pin <https://www.sparkfun.com/products/743> (PRT-00743) This device is also useful as a general connection point to wire up your design to another part of your project. Our various solder wires solder well into these plated through hole pads. Hook-Up Wire - Assortment (Stranded, 22 AWG) <https://www.sparkfun.com/products/11375> (PRT-11375) Hook-Up Wire - Assortment (Solid Core, 22 AWG) <https://www.sparkfun.com/products/11367> (PRT-11367) View the entire wire category on our website here <https://www.sparkfun.com/categories/141> Special notes: SMTSO-256-ET is a "flush mount" nut for a 4-40 screw. We mostly use this on specialty testbeds; it is a nice way to connect hardware to your PCB at an adjustable hieght. Also note, the SNAP packages are for using a snappable style connector. We sell a baggie of snaps and they are also used on two LilyPad designs: Snap Assortment - 30 pack (male and female) <https://www.sparkfun.com/products/11347> (DEV-11347) LilyPad Arduino SimpleSnap <https://www.sparkfun.com/products/10941> (DEV-10941) LilyPad SimpleSnap Protoboard <https://www.sparkfun.com/products/10940> (DEV-10940)
L1 = rcl:L-US: INDUCTOR, American symbol; SPICEPREFIX: L
LDR LDR1 = photo-elements:VT2*: Photoconductive Cell VT200 Series Source: http://optoelectronics.perkinelmer.com/content/Datasheets/DTS_vt200seriesdatasheet.pdf
LED1-LED27 LED29 = led:LED: LED OSRAM: - CHIPLED LG R971, LG N971, LY N971, LG Q971, LY Q971, LO R971, LY R971 LH N974, LH R974 LS Q976, LO Q976, LY Q976 LO Q996 - Hyper CHIPLED LW Q18S LB Q993, LB Q99A, LB R99A - SideLED LS A670, LO A670, LY A670, LG A670, LP A670 LB A673, LV A673, LT A673, LW A673 LH A674 LY A675 LS A676, LA A676, LO A676, LY A676, LW A676 LS A679, LY A679, LG A679 - Hyper Micro SIDELED® LS Y876, LA Y876, LO Y876, LY Y876 LT Y87S - SmartLED LW L88C, LW L88S LB L89C, LB L89S, LG L890 LS L89K, LO L89K, LY L89K LS L896, LA L896, LO L896, LY L896 - TOPLED LS T670, LO T670, LY T670, LG T670, LP T670 LSG T670, LSP T670, LSY T670, LOP T670, LYG T670 LG T671, LOG T671, LSG T671 LB T673, LV T673, LT T673, LW T673 LH T674 LS T676, LA T676, LO T676, LY T676, LB T676, LH T676, LSB T676, LW T676 LB T67C, LV T67C, LT T67C, LS T67K, LO T67K, LY T67K, LW E67C LS E67B, LA E67B, LO E67B, LY E67B, LB E67C, LV E67C, LT E67C LW T67C LS T679, LY T679, LG T679 LS T770, LO T770, LY T770, LG T770, LP T770 LB T773, LV T773, LT T773, LW T773 LH T774 LS E675, LA E675, LY E675, LS T675 LS T776, LA T776, LO T776, LY T776, LB T776 LHGB T686 LT T68C, LB T68C - Hyper Mini TOPLED® LB M676 - Mini TOPLED Santana® LG M470 LS M47K, LO M47K, LY M47K Source: http://www.osram.convergy.de LUXEON: - LUMILED® LXK2-PW12-R00, LXK2-PW12-S00, LXK2-PW14-U00, LXK2-PW14-V00 LXK2-PM12-R00, LXK2-PM12-S00, LXK2-PM14-U00 LXK2-PE12-Q00, LXK2-PE12-R00, LXK2-PE12-S00, LXK2-PE14-T00, LXK2-PE14-U00 LXK2-PB12-K00, LXK2-PB12-L00, LXK2-PB12-M00, LXK2-PB14-N00, LXK2-PB14-P00, LXK2-PB14-Q00 LXK2-PR12-L00, LXK2-PR12-M00, LXK2-PR14-Q00, LXK2-PR14-R00 LXK2-PD12-Q00, LXK2-PD12-R00, LXK2-PD12-S00 LXK2-PH12-R00, LXK2-PH12-S00 LXK2-PL12-P00, LXK2-PL12-Q00, LXK2-PL12-R00 Source: www.luxeon.com KINGBRIGHT: KA-3528ASYC Source: www.kingbright.com
R1 R13 R41 R61 R67 = pot:TRIM_US-: POTENTIOMETER
R2-R12 R14-R40 R42-R60 R65 R66 = rcl:R-US_: RESISTOR, American symbol; SPICEPREFIX: R
S1-S6 S8 S9 S11 S12 = SparkFun-Switches:MOMENTARY-SWITCH-SPST: Momentary Switch (Pushbutton) - SPST Normally-open (NO) SPST momentary switches (buttons, pushbuttons). Variants PTH-12MM - 12mm square, through-hole Momentary Pushbutton Switch - 12mm Square <https://www.sparkfun.com/products/9190> (COM-09190) PTH-6.0MM, PTH-6.0MM-KIT - 6.0mm square, through-hole Mini Pushbutton Switch <https://www.sparkfun.com/products/97> (COM-00097) KIT package intended for soldering kit's - only one side of pads' copper is exposed. PTH-RIGHT-ANGLE-KIT - Right-angle, through-hole Right Angle Tactile Button <https://www.sparkfun.com/products/10791> - Used on SparkFun BigTime Watch Kit <https://www.sparkfun.com/products/11734> SMD-12MM - 12mm square, surface-mount Tactile Button - SMD (12mm) <https://www.sparkfun.com/products/12993> (COM-12993) Used on SparkFun PicoBoard <https://www.sparkfun.com/products/11888> SMD-4.5MM - 4.5mm Square Trackball Switch Used on SparkFun Blackberry Trackballer Breakout <https://www.sparkfun.com/products/13169> SMD-4.6MMX2.8MM - 4.60mm x 2.80mm, surface mount Used on SparkFun Pro Micro - RP2040 <https://www.sparkfun.com/products/17717> SMD-5.2MM, SMD-5.2-REDUNDANT - 5.2mm square, surface-mount Mini Pushbutton Switch - SMD <https://www.sparkfun.com/products/8720> (COM-08720) Used on Arduino Pro Mini <https://www.sparkfun.com/products/11114> REDUNDANT package connects both switch circuits together SMD-6.0X3.5MM - 6.0 x 3.5mm, surface mount Momentary Reset Switch SMD <https://www.sparkfun.com/products/8229> (COM-08229) SMD-6.2MM-TALL - 6.2mm square, surface mount Tactile Button - SMD (6mm) <https://www.sparkfun.com/products/12992> Used on SparkFun Digital Sandbox <https://www.sparkfun.com/products/12651> SMD-RIGHT-ANGLE - Right-angle, surface mount Used on SparkFun Block for Intel® Edison - Arduino <https://www.sparkfun.com/products/13036>; PROD_ID: SWCH-08441; SF_SKU: COM-00097
S7 S10 = bt_electromech:DPDT: Dual Position, Dual Throw (DPDT) Switch
T1-T7 = transistor:BC547: NPN TRANSISTOR
X1-X4 = con-lumberg:1501_03: Klinkensteckverbinder nach JISC 6560, 2,5 mm Jack connectors according to JISC 6560, 2.5 mm Source: http://www.lumberg.com/Produkte/PDFs/1501_03.pdf; OC_FARNELL: 1200127; OC_NEWARK: unknown

## Board
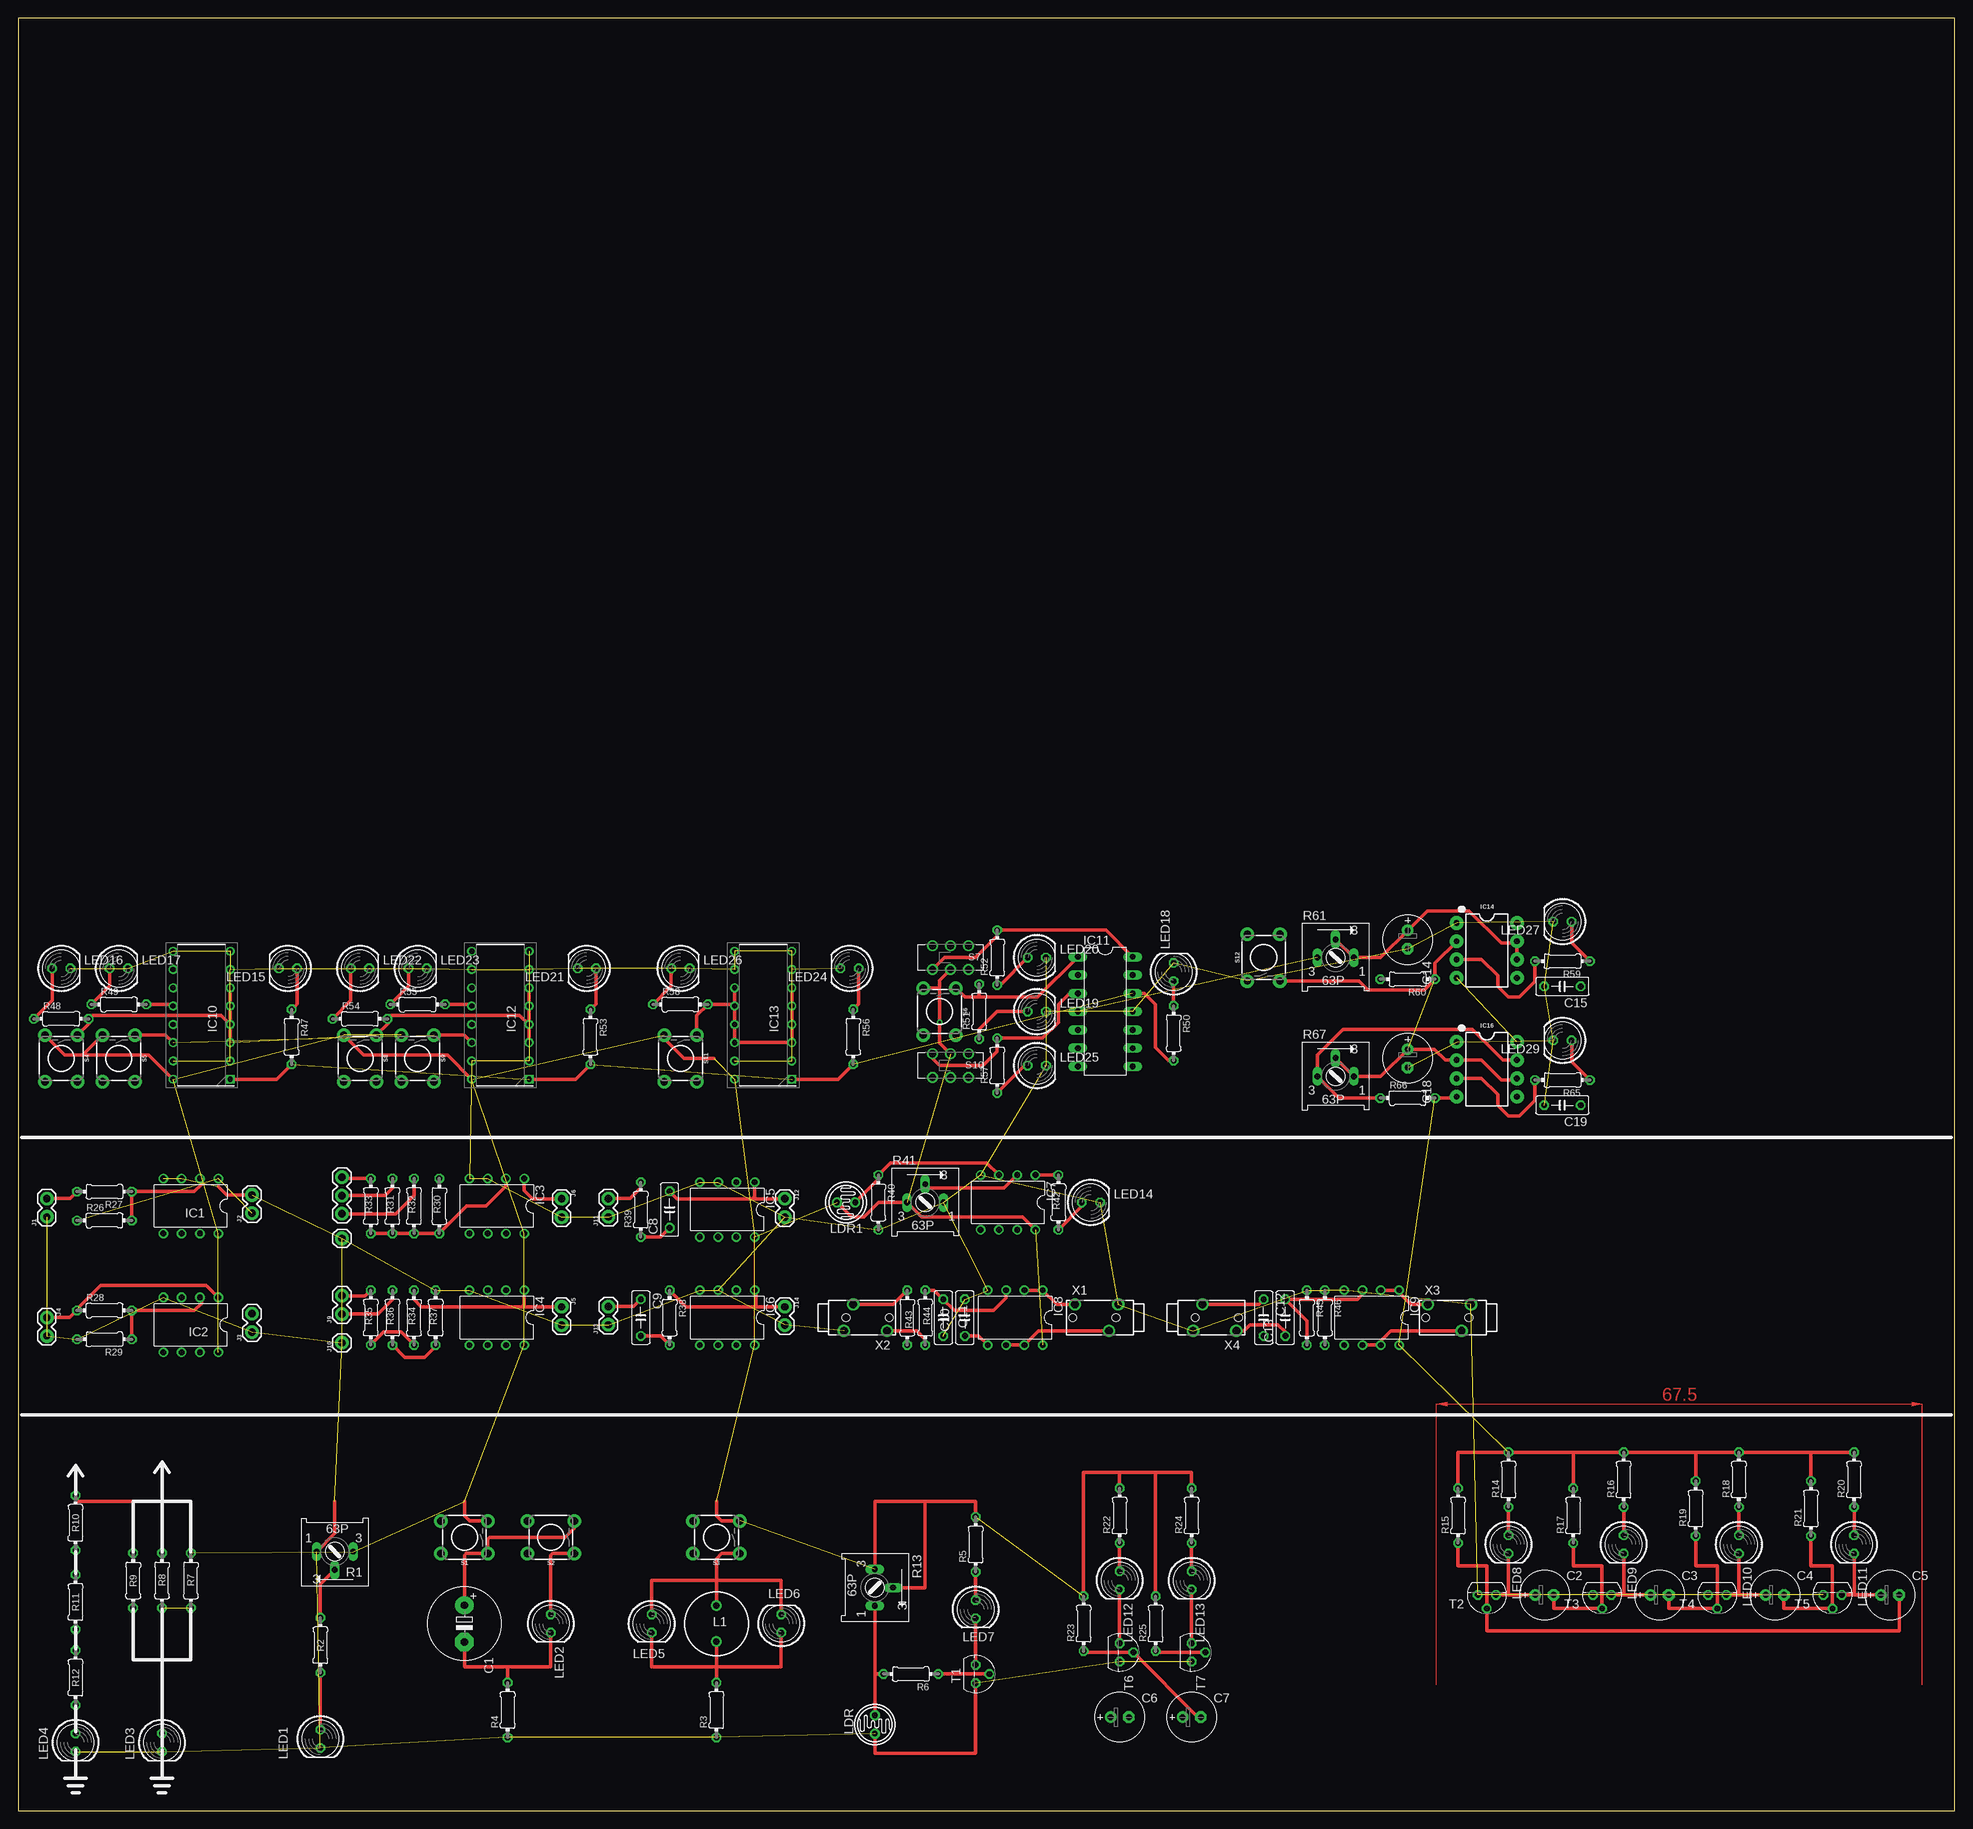
[diagram p8: board, top side]
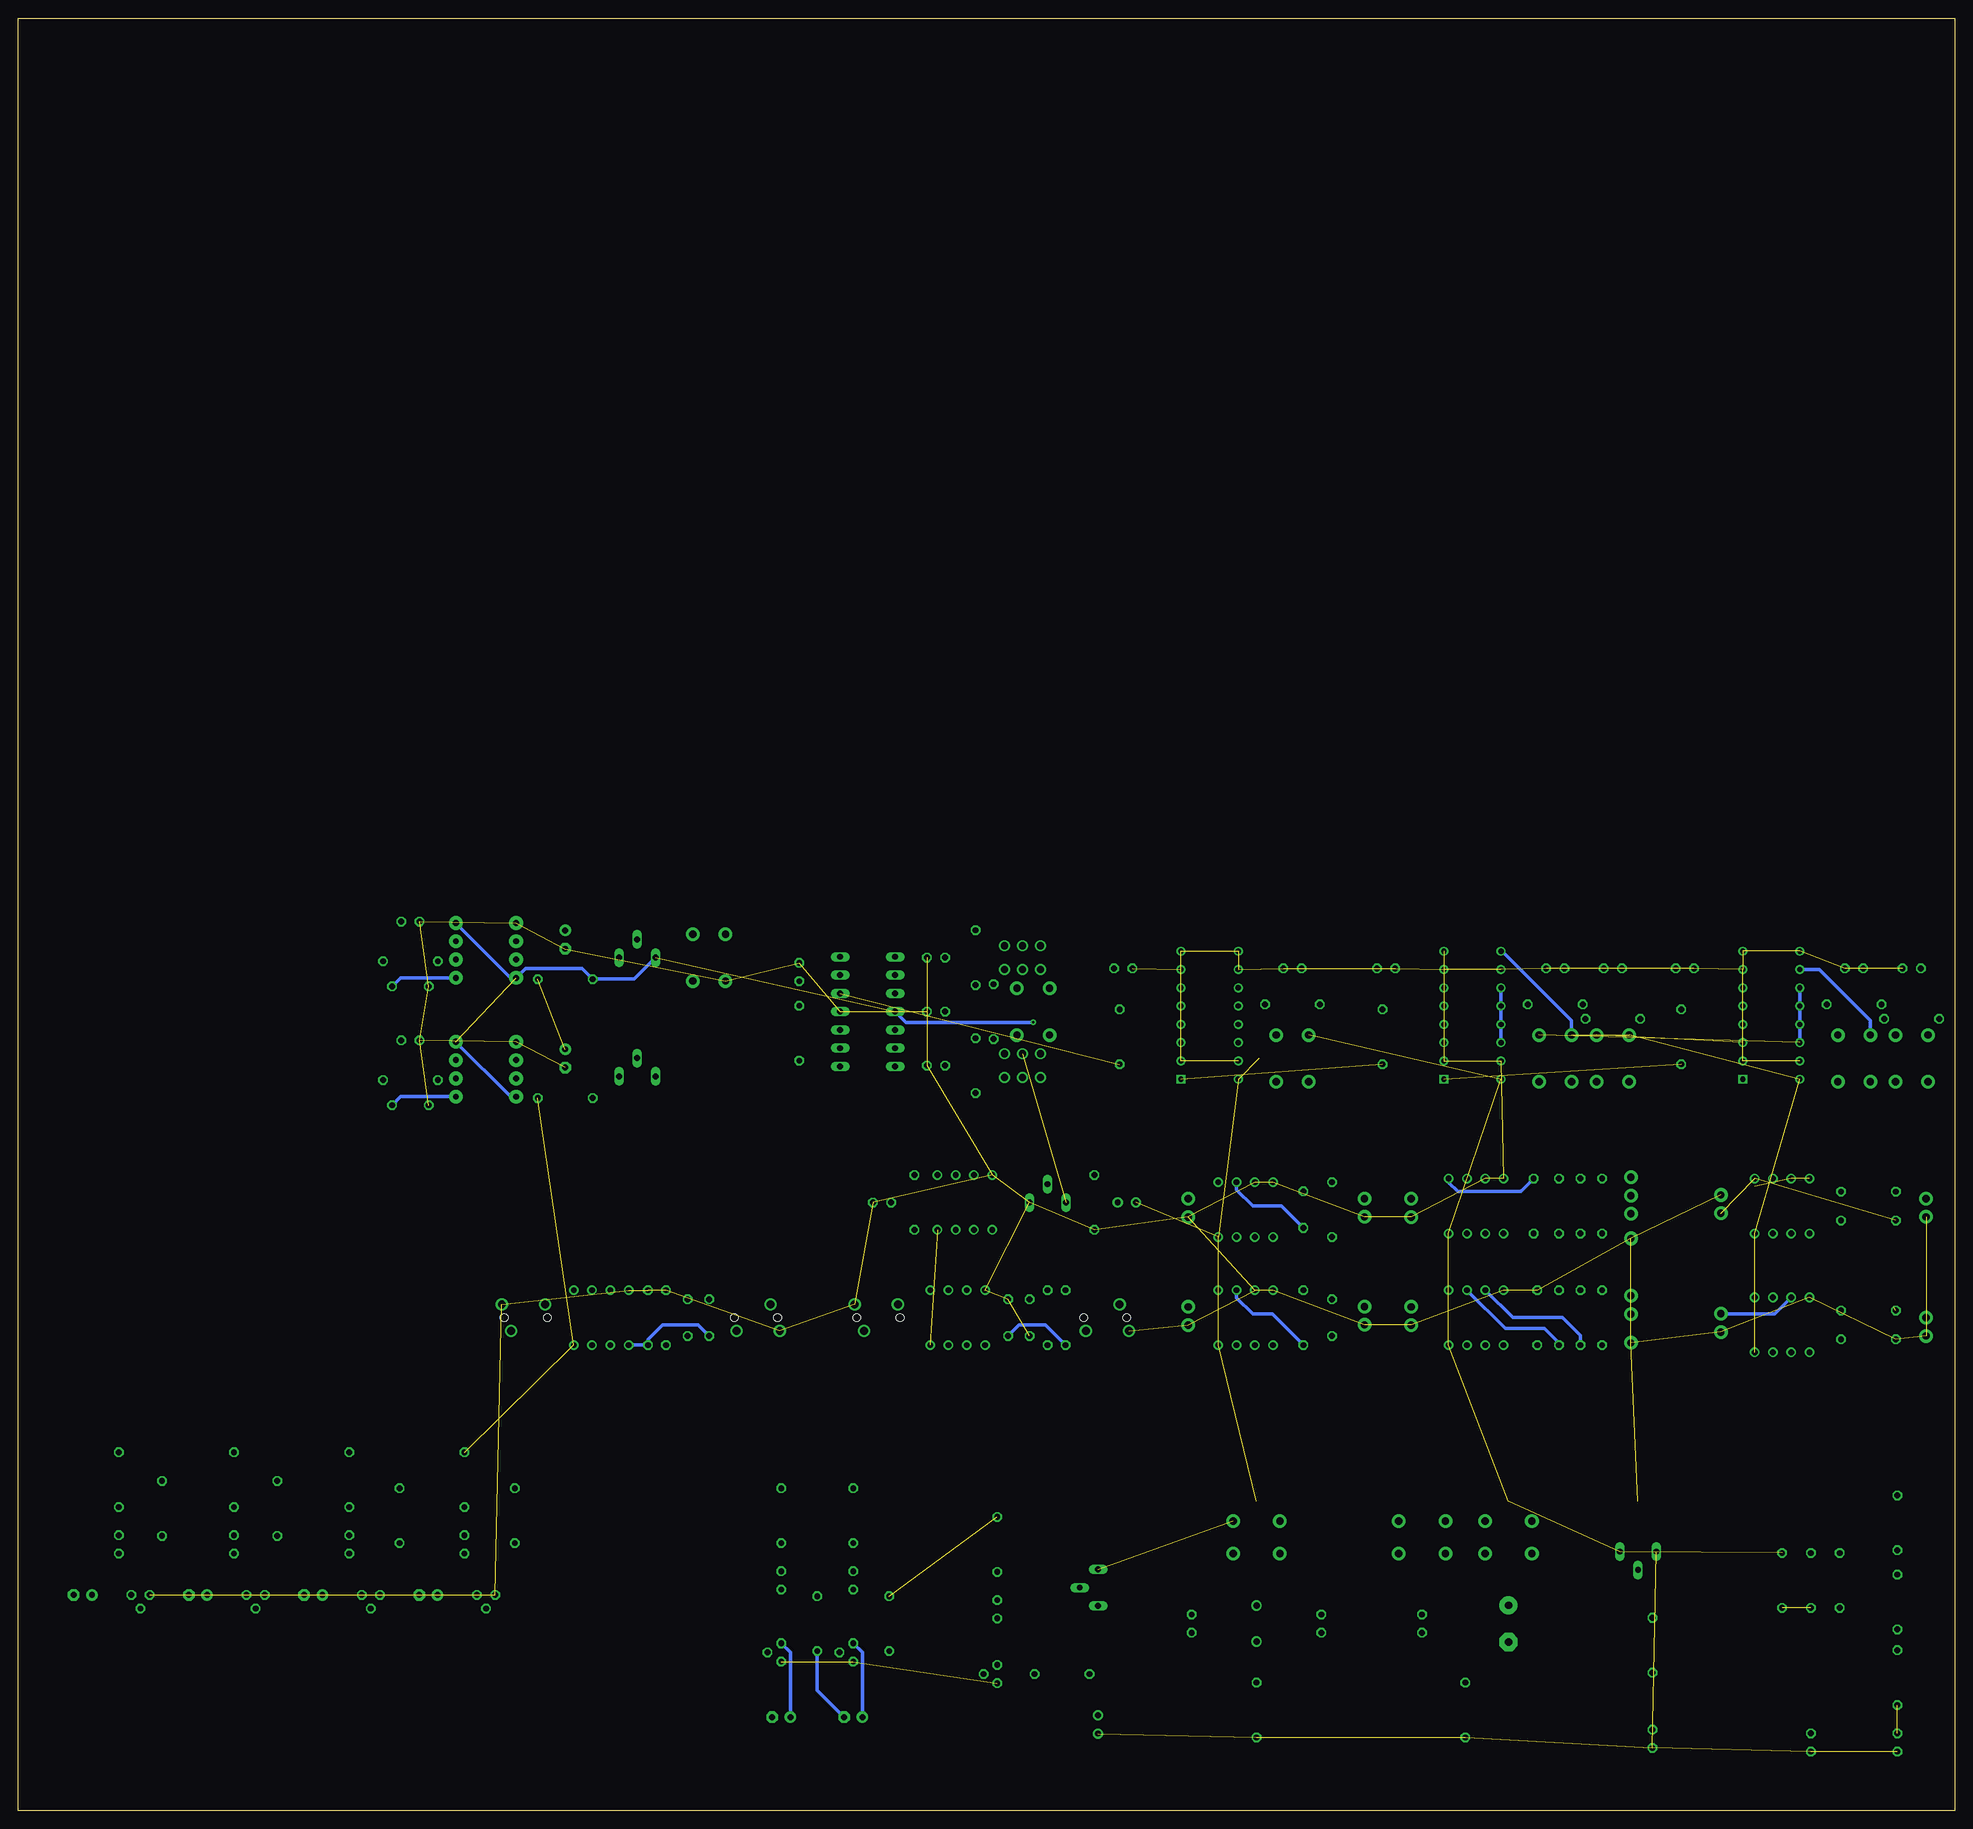
[diagram p9: board, bottom side, seen from below]

Size 269 x 249 mm. Coordinates in mm from the lower left corner, seen from the top.
Outline: 0,0 269,0 269,249 0,249 0,0
Copper layers (1*16): Top 0.035mm / dielectric 1.5mm / Bottom 0.035mm
Design rules "default": minimum track width 6mil, minimum drill 0.35mm, track to track 6mil, track to pad 6mil, pad to pad 6mil, via to via 6mil, smd to smd 6mil, copper to edge 40mil, drill to drill 6mil, minimum pad ring 10mil, minimum via ring 8mil, stop-mask expansion 4mil, vias tented up to drill 0mil, thermal gap 10mil

### Footprints (pad centres in the part's own frame; a part is rotated, then mirrored left to right if it is on the bottom)
E5-10,5 = drill 1.016 pad 2.54: + -2.54,0 | drill 1.016 pad 2.54 octagon: - 2.54,0
E2,5-7 = drill 0.813 pad 1.6: + -1.27,0 | drill 0.813 pad 1.6 octagon: - 1.27,0
C050-025X075 = drill 0.813 octagon: 1 -2.54,0; 2 2.54,0
DIL08 = drill 0.813 pad 1.27: 1 -3.81,-3.81; 2 -1.27,-3.81; 3 1.27,-3.81; 4 3.81,-3.81; 5 3.81,3.81; 6 1.27,3.81; 7 -1.27,3.81; 8 -3.81,3.81
DIP794W53P254L1930H508Q16N = drill 0.73 pad 1.13 square: 1 -3.97,8.89 | drill 0.73 pad 1.13: 2 -3.97,6.35; 3 -3.97,3.81; 4 -3.97,1.27; 5 -3.97,-1.27; 6 -3.97,-3.81; 7 -3.97,-6.35; 8 -3.97,-8.89; 9 3.97,-8.89; 10 3.97,-6.35; 11 3.97,-3.81; 12 3.97,-1.27; 13 3.97,1.27; 14 3.97,3.81; 15 3.97,6.35; 16 3.97,8.89
DIL14 = drill 0.813 long: 1 -7.62,-3.81; 2 -5.08,-3.81; 3 -2.54,-3.81; 4 0,-3.81; 5 2.54,-3.81; 6 5.08,-3.81; 7 7.62,-3.81; 8 7.62,3.81; 9 5.08,3.81; 10 2.54,3.81; 11 0,3.81; 12 -2.54,3.81; 13 -5.08,3.81; 14 -7.62,3.81
DIP08-KIT = drill 0.813 pad 1.905: 1 -3.81,-4.191; 2 -1.27,-4.191; 3 1.27,-4.191; 4 3.81,-4.191; 5 3.81,4.191; 6 1.27,4.191; 7 -1.27,4.191 | drill 0.864 pad 1.905: 8 -3.81,4.191
1X02 = drill 1.016 pad 1.88: 1 0,0; 2 2.54,0
1X03 = drill 1.016 pad 1.88: 1 0,0; 2 2.54,0; 3 5.08,0
1X01 = drill 1.016 pad 1.88: 1 0,0
6000-XXXX-RC = drill 0.9 pad 1.422: 1 -2.5,0; 2 2.5,0
TO46-VT200 = drill 0.8 pad 1.4: 1 -1.27,0; 2 1.27,0
LED5MM = drill 0.813 octagon: A -1.27,0; K 1.27,0
S63P = drill 0.813 long: A 2.54,0; E -2.54,0; S 0,2.54
0204/7 = drill 0.813 octagon: 1 -3.81,0; 2 3.81,0
TACTILE_SWITCH_PTH_6.0MM = drill 1.016 pad 1.88: 1 -3.251,2.261; 2 3.251,2.261; 3 -3.251,-2.261; 4 3.251,-2.261
DPDT_JS202011CQN = drill 1: 1 -2.5,-1.65; 2 0,-1.651; 3 2.5,-1.65; 4 -2.5,1.65; 5 0,1.651; 6 2.5,1.65
TO92 = drill 0.813 octagon: 1 1.27,0; 2 0,1.905; 3 -1.27,0
1501_03 = drill 1.1 pad 1.7: 1 -1.85,0.3; 2 1.85,-1; 3 -1.85,-5.7 | hole 1.1: 0,0; 0,-6

### Placement (x,y rotation side)
C1  62,26 270 top
C2  212,30 0 top
C3  228,30 0 top
C4  244,30 0 top
C5  260,30 0 top
C6  153,13 0 top
C7  163,13 0 top
C8  90.5,83.5 90 top
C9  86.5,68.5 270 top
C10  128.5,68.5 270 top
C11  131.5,68.5 90 top
C12  173,68.5 270 top
C13  176,68.5 90 top
C14  193,121 270 top
C15  214.5,114.5 180 top
C18  193,104.5 270 top
C19  214.5,98 180 top
IC1  24,84 180 top
IC2  24,67.5 180 top
IC3  66.5,84 180 top
IC4  66.5,68.5 180 top
IC5  98.5,83.5 180 top
IC6  98.5,68.5 180 top
IC7  137.5,84.5 180 top
IC8  138.5,68.5 180 top
IC9  188,68.5 180 top
IC10  25.5,110.5 180 top
IC11  151,111 270 top
IC12  67,110.5 180 top
IC13  103.5,110.5 180 top
IC14  204,119.5 270 top
IC16  204,103 270 top
J1  4,82.5 90 top
J2  32.5,83 90 top
J3  32.5,66.5 90 top
J4  4,68.5 270 top
J5  75.5,70 270 top
J6  75.5,85 270 top
J7  45,88 270 top
J8  45,79.5 0 top
J9  45,69 90 top
J10  45,65 90 top
J11  82,82.5 90 top
J12  106.5,85 270 top
J13  82,67.5 90 top
J14  106.5,70 270 top
L1  97,26 270 top
LDR  119,12 270 top
LDR1  115,84.5 0 top
LED1  42,10 270 top
LED2  74,26 270 top
LED3  20,9.5 270 top
LED4  8,9.5 270 top
LED5  88,26 270 top
LED6  106,26 90 top
LED7  133,28 270 top
LED8  207,37 270 top
LED9  223,37 270 top
LED10  239,37 270 top
LED11  255,37 270 top
LED12  153,32 270 top
LED13  163,32 270 top
LED14  149,84.5 0 top
LED15  37.5,117 180 top
LED16  6,117 0 top
LED17  14,117 0 top
LED18  160.5,116.5 90 top
LED19  141.5,111 0 top
LED20  141.5,118.5 0 top
LED21  79,117 180 top
LED22  47.5,117 0 top
LED23  55.5,117 0 top
LED24  115.5,117 180 top
LED25  141.5,103.5 0 top
LED26  92,117 0 top
LED27  214.5,123.5 180 top
LED29  214.5,107 180 top
R1  44,36 180 top
R2  42,23 90 top
R3  97,14 90 top
R4  68,14 90 top
R5  133,37 90 top
R6  124,19 180 top
R7  24,32 270 top
R8  20,32 270 top
R9  16,32 270 top
R10  8,40 90 top
R11  8,29 90 top
R12  8,18.5 90 top
R13  119,31 270 top
R14  207,46 90 top
R15  200,41 90 top
R16  223,46 90 top
R17  216,41 90 top
R18  239,46 90 top
R19  233,42 90 top
R20  255,46 90 top
R21  249,42 90 top
R22  153,41 90 top
R23  148,26 90 top
R24  163,41 90 top
R25  158,26 90 top
R26  12,82 0 top
R27  12,86 180 top
R28  12,69.5 0 top
R29  12,65.5 180 top
R30  58.5,84 270 top
R31  52,84 90 top
R32  55,84 90 top
R33  49,84 90 top
R34  55,68.5 270 top
R35  49,68.5 90 top
R36  52,68.5 90 top
R37  58,68.5 90 top
R38  90.5,68.5 270 top
R39  86.5,83.5 90 top
R40  119.5,84.5 270 top
R41  126,84.5 0 top
R42  144.5,84.5 90 top
R43  123.5,68.5 270 top
R44  126,68.5 90 top
R45  179,68.5 270 top
R46  181.5,68.5 270 top
R47  38,107.5 270 top
R48  6,110 0 top
R49  14,112 0 top
R50  160.5,108 270 top
R51  133.5,111 90 top
R52  136,118.5 90 top
R53  79.5,107.5 270 top
R54  47.5,110 0 top
R55  55.5,112 0 top
R56  116,107.5 270 top
R57  136,103.5 90 top
R58  92,112 0 top
R59  214.5,118 180 top
R60  193,115.5 180 top
R61  183,118.5 0 top
R65  214.5,101.5 180 top
R66  193,99 0 top
R67  183,102 0 top
S1  62,38 180 top
S2  74,38 180 top
S3  97,38 180 top
S4  6,104.5 270 top
S5  14,104.5 270 top
S6  128,111 270 top
S7  129.5,118.5 180 top
S8  47.5,104.5 270 top
S9  55.5,104.5 270 top
S10  129.5,103.5 180 top
S11  92,104.5 270 top
S12  173,118.5 90 top
T1  133,19 270 top
T2  204,30 180 top
T3  220,30 180 top
T4  236,30 180 top
T5  252,30 180 top
T6  153,22 270 top
T7  163,22 270 top
X1  152.5,68.5 270 top
X2  115,68.5 90 top
X3  201.5,68.5 270 top
X4  163.5,68.5 90 top

### Tracks (layer width: path | path; a pad name or v marks a point on that pad's centre or on a via)
5V  (via drill 0.35)  (23 unrouted)
  Top 0.508: 8,46 R10.2 8,43 16,43 | 16,43 20,43 | R7.1 24,43 20,43 | R8.1 20,43 | R9.1 16,43 | S1.3 62.74,40.26 62,41 62,43 | S3.3 97.74,40.26 97,41 97,43 | R13.E 119,43 126,43 | 126,43 133,43 R5.2 | R13.S 126,31 126,43 | R15.2 200,49.81 R14.2 216,49.81 | 216,49.81 R16.2 233,49.81 | 233,49.81 R18.2 249,49.81 | 249,49.81 R20.2 | R21.2 249,49.81 | R19.2 233,49.81 | R17.2 216,49.81 | R25.2 158,47 | 158,47 163,47 R24.2 | R22.2 153,47 | 153,47 158,47 | 153,47 148,47 R23.2 | LDR1.1 115.73,82.5 117.5,82.5 119.5,84.5 R41.E 125.46,82.5 139.5,82.5 IC7.8 | S5.3 8.99,105 | S4.3 6.49,105 8.99,105 | IC10.16 18.14,105 8.99,105 | S8.3 47.99,105 59.64,105 IC12.16 | S11.3 89.74,107.25 92.49,104.5 96.64,104.5 | S7.5 128,115.35 128,114.35 127.9,114.25 127.75,114.25 | 127.75,114.25 S6.3 | S10.2 128,106.65 v128,109.5 128,114 127.75,114.25 | IC16.4 199.62,99 R66.2
  Bottom 0.508: IC10.10 18.85,116.85 11.74,109.74 S5.3 | S9.3 53.24,109.74 62.89,119.39 IC12.9 | IC11.4 145.69,109.5 v128,109.5 | IC14.8 200.57,115.69 IC14.4 198.5,117 190.69,117 R60.2 183.46,115.5 R61.E | IC16.8 200.57,99.19 IC16.4
CLK
  Top 0.508: IC11.1 141.57,113 133.5,113 | S6.1 131.51,113 133.5,113 | R51.2 133.5,113
GND  (88 unrouted)
  Top 0.508: R1.A 44,38.54 44,43 | LDR.2 119,8 133,8 T1.1 | J2.2 28.96,85.54 27.81,86.69
IN
  Top 0.508: IC13.6 IC13.5 IC13.4 IC13.3 IC13.14 IC13.13 IC13.12 | S11.1 94.26,110.45 R58.2 99.3,112 IC13.12 | IC13.11 IC13.12
IN1  (1 unrouted)
  Top 0.508: S4.1 9.81,109.3 R48.2 10.31,110.5 28.2,110.5 IC10.4 | IC10.3 IC10.4 | IC10.4 IC10.5 IC10.6 | S8.1 51.31,109.3 R54.2 51.81,110.5 69.7,110.5 IC12.4 | IC12.3 IC12.4 | IC12.4 IC12.5 IC12.6
IN2  (1 unrouted)
  Top 0.508: R49.2 21.3,112 IC10.12 | S5.1 20.47,107.75 IC10.14 | R55.2 62.8,112 IC12.12 | S9.1 61.97,107.75 IC12.14
  Bottom 0.508: IC10.14 IC10.13 IC10.12 IC10.11 | IC12.14 IC12.13 IC12.12 IC12.11
J
  Top 0.508: S7.6 128.65,118.5 133,118.5 136,121.5 R52.2 151.12,122.31 IC11.14
K
  Top 0.508: S10.3 127,104.5 128,103.5 134,103.5 136,105.5 R57.2 142.31,107.31 144.5,109.5 144.5,112 146.04,113.54 IC11.3
N$1  (1 unrouted)
N$2
  Top 0.508: R1.S 42,31.46 R2.2
N$3
  Top 0.508: R2.1 LED1.A
N$4
  Top 0.508: C1.+ 62,35.49 62.25,35.74 S1.1 65.25,37.74 65.51,38 75.99,38 77.25,39.26 S2.3
N$5
  Top 0.508: C1.- 62,20 68,20 | LED2.K 74,20 68,20 | 68,20 R4.2
N$6
  Top 0.508: R10.1 R11.2
N$7
  Top 0.508: R11.1 R12.2
N$8  (1 unrouted)
  Top 0.508: LED3.A R8.2 | R7.2 24,21 16,21 R9.2
N$10
  Top 0.508: S2.1 74.25,35.74 74,35.49 LED2.A
N$11
  Top 0.508: S3.1 97.74,35.74 97,35 97,32 | L1.1 97,32 | LED5.A 88,32 97,32 | 97,32 106,32 LED6.K
N$12
  Top 0.508: 97,20 106,20 LED6.A | R3.2 97,20 | 97,20 L1.2 | 97,20 88,20 LED5.K
N$13
  Top 0.508: R6.1 T1.2
N$14
  Top 0.508: R13.A 119,19 | 119,19 R6.2 | 119,19 LDR.1
N$15
  Top 0.508: LED12.K T6.3
  Bottom 0.508: C6.+ 151.73,22 T6.3
N$16
  Top 0.508: LED7.K T1.3
N$17
  Top 0.508: LED7.A R5.1
N$18
  Top 0.508: R17.1 216,34 220,34 T3.2 213.27,28.09 C2.-
N$19
  Top 0.508: LED8.K 207,30 | 207,30 T2.3 | C2.+ 207,30
N$20
  Top 0.508: LED8.A R14.1
N$21
  Top 0.508: C3.+ 223,30 | 223,30 T3.3 | LED9.K 223,30
N$22
  Top 0.508: R16.1 LED9.A
N$23
  Top 0.508: R29.1 R28.2 24.5,69.5 25.5,70.5 25.5,71.08 IC2.2
N$24
  Top 0.508: R19.1 233,34 236,34 T4.2 229.27,28.09 C3.-
N$25
  Top 0.508: C4.+ 239,30 | 239,30 T4.3 | LED10.K 239,30
N$26
  Top 0.508: LED10.A R18.1
N$27
  Bottom 0.508: IC2.3 25,69.04 J3.2
N$28
  Top 0.508: R21.1 249,34 252,34 T5.2 245.27,28.09 C4.-
N$29
  Top 0.508: LED11.K 255,30 | 255,30 C5.+ | T5.3 255,30
N$30
  Top 0.508: LED11.A R20.1
N$31
  Top 0.508: IC1.2 25.5,87.58 25.5,87 24.5,86 R27.1 R26.2
N$32
  Top 0.508: R15.1 200,34 204,34 T2.2 204,25 261.27,25 C5.-
N$33
  Top 0.508: LED12.A R22.1
N$34
  Top 0.508: T7.2 158,22 R25.1
  Bottom 0.508: R25.1 158,16.73 C6.-
N$35
  Top 0.508: LED13.K T7.3
  Bottom 0.508: T7.3 161.73,22 C7.+
N$36
  Top 0.508: R24.1 LED13.A
N$37
  Top 0.508: J1.2 7.23,85.04 R27.2
N$38  (1 unrouted)
  Top 0.508: J4.1 7.19,68.5 R28.1 | IC2.1 26.12,73 11.5,73 8.5,70
N$39
  Top 0.508: R33.1 R31.1 R32.1 R30.2 62.31,84 65,84 67.77,86.77 IC3.2
N$40
  Top 0.508: J7.2 50.96,85.46 52,86.5 R31.2
N$41
  Top 0.508: J7.3 52.42,82.92 55,85.5 R32.2
N$42
  Top 0.508: R33.2 45.19,87.81 J7.1
N$43  (2 unrouted)
N$44
  Top 0.508: J6.1 71.5,85 70.31,86.19 IC3.1
  Bottom 0.508: R30.1 60.31,86 69,86 70.31,87.31 IC3.1
N$45
  Top 0.508: R35.1 50.81,66.5 53.19,66.5 R34.2
  Bottom 0.508: IC4.2 62.46,67 57,67 55,65 R34.2
N$46
  Top 0.508: R23.1 148,22 T6.2 163.91,13 C7.-
N$47
  Top 0.508: J9.2 48.23,71.54 R35.2
N$48
  Top 0.508: R36.1 53.69,63 56.5,63 58,64.5 R37.1
  Bottom 0.508: IC4.3 61.42,68.5 54.5,68.5 52,66 R36.1
N$49
  Top 0.508: J9.1 50,69 52,71 R36.2
N$50
  Top 0.508: R34.1 55,71 56,70 70,70 | 70,70 70.31,70.31 IC4.1 | J5.1 70,70
N$51
  Top 0.508: C8.1 89.23,79.69 R39.1
  Bottom 0.508: IC5.2 99.77,86.27 97.5,84 93.54,84 C8.1
N$52
  Top 0.508: J11.2 85.04,85.04 86.5,86.5 R39.2
N$53
  Top 0.508: C8.2 91.54,85 102,85 | 102,85 J12.1 | IC5.1 102.31,85.31 102,85
N$54
  Top 0.508: C9.2 89.23,65.96 R38.2
  Bottom 0.508: IC6.2 99.77,71.27 97.5,69 94.81,69 R38.2
N$55
  Top 0.508: C9.1 85.5,70.04 J13.2
N$56
  Top 0.508: R38.1 92.81,70 102.5,70 | 102.5,70 J14.1 | IC6.1 102.5,72.12 102.5,70
N$57
  Top 0.508: LDR1.2 119.5,87.73 R40.1 121.19,90 134.54,90 IC7.3
N$58
  Top 0.508: IC7.2 136.96,86.5 126.54,86.5 R41.S
N$59
  Top 0.508: R42.1 147.73,83.92 LED14.A
N$60
  Top 0.508: R42.2 IC7.1
N$61
  Top 0.508: R43.1 121.54,70.35 X2.2
N$62
  Top 0.508: X2.3 124.85,66.65 126,65.5 R44.1
N$63
  Top 0.508: R44.2 127.23,72.31 C10.1 130.04,69.5 135.5,69.5 137.23,71.23 IC8.3
N$64
  Top 0.508: IC8.2 IC8.1 144.27,70.35 X1.3
N$65
  Top 0.508: C11.1 133.42,65.96 IC8.5
  Bottom 0.508: R43.2 126.31,67.5 129.96,67.5 C11.1
N$66
  Top 0.508: IC8.6 IC8.7 141.73,66.65 X1.2
N$67
  Top 0.508: X4.2 172.31,70.35 C12.1
N$68
  Top 0.508: X4.3 169.23,66.68 170.25,66.68 171.07,67.5 175,67.5 176,66.5 C13.1
N$69
  Top 0.508: R45.2 179,68.04 C13.2 186.04,71.04 186.73,71.73 IC9.3
N$70
  Top 0.508: IC9.2 191.5,72.31 | 191.5,72.31 IC9.1 | X3.3 193.46,70.35 191.5,72.31
N$71
  Bottom 0.508: C12.2 174.54,67.5 179.5,67.5 181.5,65.5 R46.2 IC9.5
N$72
  Top 0.508: IC9.6 IC9.7 189.27,65.27 190.65,66.65 X3.2
N$73
  Top 0.508: LED16.A 4.73,112.54 R48.1
N$74
  Top 0.508: R49.1 12.73,114.54 LED17.A
N$75
  Top 0.508: R50.1 LED18.A
N$76
  Top 0.508: R47.1 38.77,112.08 LED15.A
N$77
  Top 0.508: LED19.A 136,111 133.5,108.5 R51.1
N$78
  Top 0.508: LED20.A 136.42,114.69 R52.1
N$79
  Top 0.508: R53.1 80.27,112.08 LED21.A
N$80
  Top 0.508: LED22.A 46.23,112.54 R54.1
N$81
  Top 0.508: R55.1 54.23,114.54 LED23.A
N$82
  Top 0.508: R56.1 116.77,112.08 LED24.A
N$83
  Top 0.508: R57.1 139.81,103.5 LED25.A
N$84
  Top 0.508: R58.1 90.73,114.54 LED26.A
N$85
  Top 0.508: R59.1 215.77,120.54 LED27.A
N$86
  Bottom 0.508: IC14.5 215.85,115.69 C15.1
N$87
  Top 0.508: R61.S R61.A 189.23,118.5 C14.+ 195.73,125 201.5,125 206,120.5 207.92,120.5 IC14.7 IC14.6
N$88
  Top 0.508: R66.1 183.46,99 R67.E 180.46,104.96 184,108.5 202,108.5 206.23,104.27 IC16.7
N$91
  Top 0.508: R65.1 215.77,104.04 LED29.A
N$93
  Bottom 0.508: IC16.5 215.85,99.19 C19.1
OUT  (3 unrouted)
  Top 0.508: IC10.1 35.92,101.61 R47.2 | IC12.1 77.42,101.61 R53.2 | IC13.1 113.92,101.61 R56.2 | IC11.12 156.46,113.54 158,112 158,106 159.81,104.19 R50.2
OUT1
  Top 0.508: IC14.3 203.27,118.23 205.5,116 205.5,114.5 207,113 208.5,113 210.69,115.19 R59.2
OUT3
  Top 0.508: IC16.3 203.27,101.73 205.5,99.5 205.5,98 207,96.5 208.5,96.5 210.69,98.69 R65.2
TRIG  (1 unrouted)
  Top 0.508: S12.3 186.25,115.25 187.5,114 195.31,114 R60.1 196.81,117.77 IC14.2 | R67.S R67.A 189.23,102 C18.+ 196.73,105.77 198.23,104.27 IC16.2 203.23,104.27 206,101.5 207.96,101.5 IC16.6
(copper drawn outside any net)
  shapes: Top area x1